# Altium project SAM9260-BSC-DK.PrjPcb (part 1 of 2)
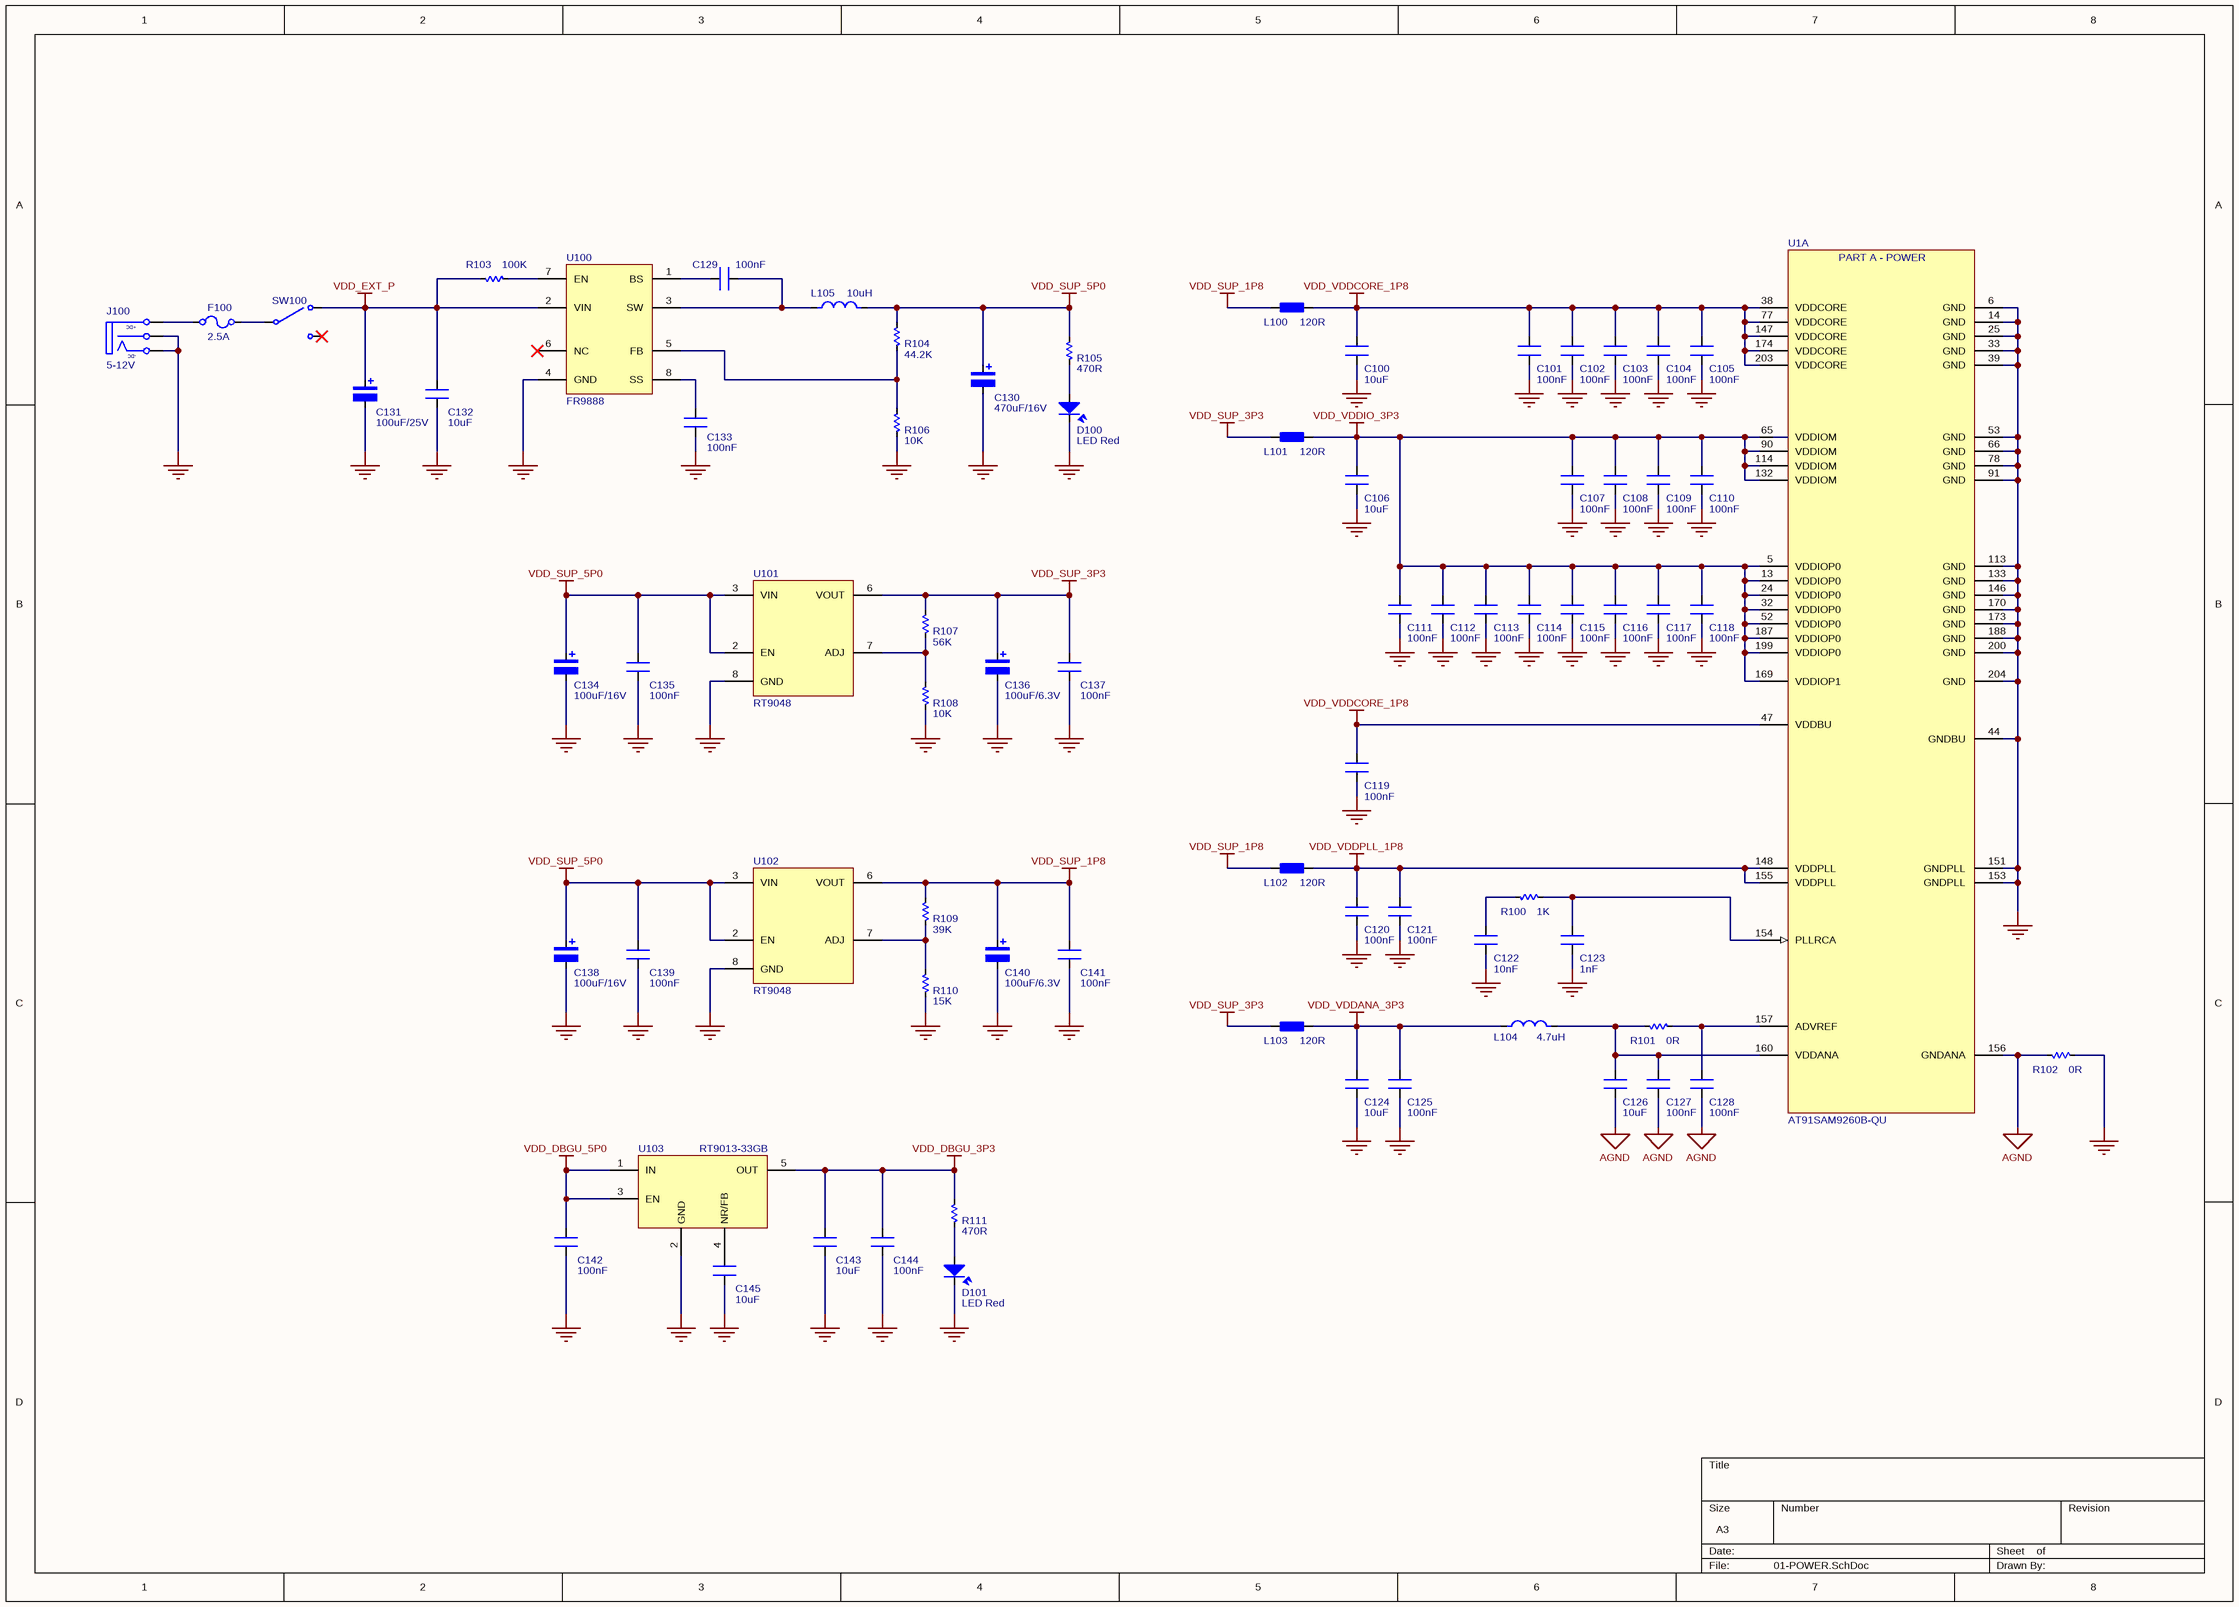
[diagram p0: 01-POWER.SchDoc]
7 sheets, 350 parts. Net scope: global (net labels, ports and power ports of the same name join across sheets).
Board file: SAM9260-BSC-DK.PcbDoc
Sheets:
  01-POWER.SchDoc
  02-MCU.SchDoc
  03-MEMORY.SchDoc
  04-ETHERNET.SchDoc
  05-SERIAL&USB.SchDoc
  06-AUDIO.SchDoc
  07-MISC.SchDoc

## Sheet 01-POWER.SchDoc
size A3

### Parts
C100  value 10uF  [CN-SMD-0603]  (hidden comment: Capacitor)
C101  value 100nF  [CN-SMD-0603]  (hidden comment: Capacitor)
C102  value 100nF  [CN-SMD-0603]  (hidden comment: Capacitor)
C103  value 100nF  [CN-SMD-0603]  (hidden comment: Capacitor)
C104  value 100nF  [CN-SMD-0603]  (hidden comment: Capacitor)
C105  value 100nF  [CN-SMD-0603]  (hidden comment: Capacitor)
C106  value 10uF  [CN-SMD-0603]  (hidden comment: Capacitor)
C107  value 100nF  [CN-SMD-0603]  (hidden comment: Capacitor)
C108  value 100nF  [CN-SMD-0603]  (hidden comment: Capacitor)
C109  value 100nF  [CN-SMD-0603]  (hidden comment: Capacitor)
C110  value 100nF  [CN-SMD-0603]  (hidden comment: Capacitor)
C111  value 100nF  [CN-SMD-0603]  (hidden comment: Capacitor)
C112  value 100nF  [CN-SMD-0603]  (hidden comment: Capacitor)
C113  value 100nF  [CN-SMD-0603]  (hidden comment: Capacitor)
C114  value 100nF  [CN-SMD-0603]  (hidden comment: Capacitor)
C115  value 100nF  [CN-SMD-0603]  (hidden comment: Capacitor)
C116  value 100nF  [CN-SMD-0603]  (hidden comment: Capacitor)
C117  value 100nF  [CN-SMD-0603]  (hidden comment: Capacitor)
C118  value 100nF  [CN-SMD-0603]  (hidden comment: Capacitor)
C119  value 100nF  [CN-SMD-0603]  (hidden comment: Capacitor)
C120  value 100nF  [CN-SMD-0603]  (hidden comment: Capacitor)
C121  value 100nF  [CN-SMD-0603]  (hidden comment: Capacitor)
C122  value 10nF  [CN-SMD-0603]  (hidden comment: Capacitor)
C123  value 1nF  [CN-SMD-0603]  (hidden comment: Capacitor)
C124  value 10uF  [CN-SMD-0603]  (hidden comment: Capacitor)
C125  value 100nF  [CN-SMD-0603]  (hidden comment: Capacitor)
C126  value 10uF  [CN-SMD-0603]  (hidden comment: Capacitor)
C127  value 100nF  [CN-SMD-0603]  (hidden comment: Capacitor)
C128  value 100nF  [CN-SMD-0603]  (hidden comment: Capacitor)
C129  value 100nF  [CN-SMD-0603]  (hidden comment: Capacitor)
C130  value 470uF/16V  [C-ALU-SMD-D6.3W6.6L7.7]  (hidden comment: Cap_Aluminum)
C131  value 100uF/25V  [C-ALU-SMD-D6.3W6.6L7.7]  (hidden comment: Cap_Aluminum)
C132  value 10uF  [CN-SMD-0603]  (hidden comment: Capacitor)
C133  value 100nF  [CN-SMD-0603]  (hidden comment: Capacitor)
C134  value 100uF/16V  [C-TAL-SMD-7343-31]  (hidden comment: Cap_Tantalum)
C135  value 100nF  [CN-SMD-0603]  (hidden comment: Capacitor)
C136  value 100uF/6.3V  [C-TAL-SMD-3216-18]  (hidden comment: Cap_Tantalum)
C137  value 100nF  [CN-SMD-0603]  (hidden comment: Capacitor)
C138  value 100uF/16V  [C-TAL-SMD-7343-31]  (hidden comment: Cap_Tantalum)
C139  value 100nF  [CN-SMD-0603]  (hidden comment: Capacitor)
C140  value 100uF/6.3V  [C-TAL-SMD-3216-18]  (hidden comment: Cap_Tantalum)
C141  value 100nF  [CN-SMD-0603]  (hidden comment: Capacitor)
C142  value 100nF  [CN-SMD-0603]  (hidden comment: Capacitor)
C143  value 10uF  [CN-SMD-0603]  (hidden comment: Capacitor)
C144  value 100nF  [CN-SMD-0603]  (hidden comment: Capacitor)
C145  value 10uF  [CN-SMD-0603]  (hidden comment: Capacitor)
D100  LED Red  [LED-SMD-0805-RED]
D101  LED Red  [LED-SMD-0805-RED]
F100  2.5A  [FUSE-SMD-1812]
J100  5-12V  [JACK-DC_5.5x2.1]
L100  value 120R  [L-SMD-0603]  (hidden comment: Ferrite bead)
L101  value 120R  [L-SMD-0603]  (hidden comment: Ferrite bead)
L102  value 120R  [L-SMD-0603]  (hidden comment: Ferrite bead)
L103  value 120R  [L-SMD-0603]  (hidden comment: Ferrite bead)
L104  value 4.7uH  [L-SMD-0603]  (hidden comment: Inductor)
L105  value 10uH  [L-SMD-0630]  (hidden comment: Inductor)
R100  value 1K  [RES-SMD-0603]  (hidden comment: Resistor)
R101  value 0R  [RES-SMD-0603]  (hidden comment: Resistor)
R102  value 0R  [RES-SMD-0603]  (hidden comment: Resistor)
R103  value 100K  [RES-SMD-0603]  (hidden comment: Resistor)
R104  value 44.2K  [RES-SMD-0603]  (hidden comment: Resistor)
R105  value 470R  [RES-SMD-0603]  (hidden comment: Resistor)
R106  value 10K  [RES-SMD-0603]  (hidden comment: Resistor)
R107  value 56K  [RES-SMD-0603]  (hidden comment: Resistor)
R108  value 10K  [RES-SMD-0603]  (hidden comment: Resistor)
R109  value 39K  [RES-SMD-0603]  (hidden comment: Resistor)
R110  value 15K  [RES-SMD-0603]  (hidden comment: Resistor)
R111  value 470R  [RES-SMD-0603]  (hidden comment: Resistor)
SW100  SW3-SLIDE  [SW3_SS12F23]  (value not drawn)
U1  AT91SAM9260B-QU  [PQFP50P3060X3060X410-208N]  (part A of 6)
U100  FR9888  [SOIC127P600X175_HS-9N]
U101  RT9048  [SOIC127P600X175_HS-9N]
U102  RT9048  [SOIC127P600X175_HS-9N]
U103  RT9013-33GB  [SOT95P245X110-5N]

### Nets
AGND: C126.1 C127.1 C128.1 R102.2 U1.156(GNDANA)
GND: C100.1 C101.1 C102.1 C103.1 C104.1 C105.1 C106.1 C107.1 C108.1 C109.1 C110.1 C111.1 C112.1 C113.1 C114.1 C115.1 C116.1 C117.1 C118.1 C119.1 C120.1 C121.1 C122.1 C123.1 C124.1 C125.1 C130.2 C131.2 C132.1 C133.1 C134.2 C135.1 C136.2 C137.1 C138.2 C139.1 C140.2 C141.1 C142.1 C143.1 C144.1 C145.1 D100.2 D101.2 J100.2(-DC) J100.3 R102.1 R106.2 R108.2 R110.2 U1.6(GND) U1.14(GND) U1.25(GND) U1.33(GND) U1.39(GND) U1.44(GNDBU) U1.53(GND) U1.66(GND) U1.78(GND) U1.91(GND) U1.113(GND) U1.133(GND) U1.146(GND) U1.151(GNDPLL) U1.153(GNDPLL) U1.170(GND) U1.173(GND) U1.188(GND) U1.200(GND) U1.204(GND) U100.4(GND) U101.8(GND) U102.8(GND) U103.2(GND)
VDD_DBGU_3P3: C143.2 C144.2 R111.1 U103.5(OUT)
VDD_DBGU_5P0: C142.2 U103.1(IN) U103.3(EN)
VDD_EXT_P: C131.1 C132.2 R103.2 SW100.1 U100.2(VIN)
VDD_SUP_1P8: C140.1 C141.2 L100.2 L102.2 R109.1 U102.6(VOUT)
VDD_SUP_3P3: C136.1 C137.2 L101.2 L103.2 R107.1 U101.6(VOUT)
VDD_SUP_5P0: C130.1 C134.1 C135.2 C138.1 C139.2 L105.2 R104.1 R105.1 U101.2(EN) U101.3(VIN) U102.2(EN) U102.3(VIN)
VDD_VDDANA_3P3: C124.2 C125.2 L103.1 L104.2
VDD_VDDCORE_1P8: C100.2 C101.2 C102.2 C103.2 C104.2 C105.2 C119.2 L100.1 U1.38(VDDCORE) U1.47(VDDBU) U1.77(VDDCORE) U1.147(VDDCORE) U1.174(VDDCORE) U1.203(VDDCORE)
VDD_VDDIO_3P3: C106.2 C107.2 C108.2 C109.2 C110.2 C111.2 C112.2 C113.2 C114.2 C115.2 C116.2 C117.2 C118.2 L101.1 U1.5(VDDIOP0) U1.13(VDDIOP0) U1.24(VDDIOP0) U1.32(VDDIOP0) U1.52(VDDIOP0) U1.65(VDDIOM) U1.90(VDDIOM) U1.114(VDDIOM) U1.132(VDDIOM) U1.169(VDDIOP1) U1.187(VDDIOP0) U1.199(VDDIOP0)
VDD_VDDPLL_1P8: C120.2 C121.2 L102.1 U1.148(VDDPLL) U1.155(VDDPLL)
NetC122_2: C122.2 R100.2
NetC123_2: C123.2 R100.1 U1.154(PLLRCA)
NetC126_2: C126.2 C127.2 L104.1 R101.2 U1.160(VDDANA)
NetC128_2: C128.2 R101.1 U1.157(ADVREF)
NetC129_1: C129.1 L105.1 U100.3(SW)
NetC129_2: C129.2 U100.1(BS)
NetC133_2: C133.2 U100.8(SS)
NetC145_2: C145.2 U103.4(NR/FB)
NetD100_1: D100.1 R105.2
NetD101_1: D101.1 R111.2
NetF100_1: F100.1 J100.1(+DC)
NetF100_2: F100.2 SW100.2
NetR103_1: R103.1 U100.7(EN)
NetR104_2: R104.2 R106.1 U100.5(FB)
NetR107_2: R107.2 R108.1 U101.7(ADJ)
NetR109_2: R109.2 R110.1 U102.7(ADJ)

Not connected (* = marked no-connect by the designer): SW100 3*; U100 6(NC)*

### Notes on the sheet
- (in symbol AT91SAM9260B-QU, part A) PART A - POWER

### Library data of the parts
C100 C106 C124 C126 = Cap: Ceramic Capacitor SMD 0603 10uF ±20% 10V
C101-C105 C107-C121 C125 C127-C129 C133 = Cap: Ceramic Capacitor SMD 0603 100nF ±20% 10V
C122 = Cap: Ceramic Capacitor SMD 0603 10nF ±20% 10V
C123 = Cap: Ceramic Capacitor SMD 0603 1nF ±20% 10V
C130 = Cap_Aluminum: Aluminum Capacitor SMD 470uF 16V
C131 = Cap_Aluminum: Aluminum Capacitor SMD 100uF 25V
C132 C143 C145 = Cap: Ceramic Capacitor SMD 0805 10uF ±20% 25V
C134 C138 = Cap_Tantalum: Tantalum Capacitor SMD 7343 100uF ±20% 16V
C135 C137 C139 C141 C142 C144 = Cap: Ceramic Capacitor SMD 0805 100nF ±20% 25V
C136 C140 = Cap_Tantalum: Tantalum Capacitor SMD 3216 100uF ±20% 6.3V
D100 D101 = LED: Light Emitting Diode SMD 0805 red color
F100 = FUSE: Fuse SMD1812 2.5A
J100 = DC_INPUT: DC Power Jack input 5.5x2.1mm
L100-L103 = Ferrite bead: Ferrite bead SMD 0603 120 Ohm @100MHz
L104 = Inductor: Common Inductor SMD 0603 4.7uH ±20%
L105 = Inductor: Power Inductor SMD 6.6x6.6x3mm
R100 = Res: Resistor SMD 0603 1K 1% 0.1W
R101 R102 = Res: Resistor SMD 0603 0R 1% 0.1W
R103 = Res: Resistor SMD 0603 100K 1% 0.1W
R104 = Res: Resistor SMD 0603 44.2K 1% 0.1W
R105 R111 = Res: Resistor SMD 0603 470R 1% 0.1W
R106 R108 = Res: Resistor SMD 0603 10K 1% 0.1W
R107 = Res: Resistor SMD 0603 56K 1% 0.1W
R109 = Res: Resistor SMD 0603 39K 1% 0.1W
R110 = Res: Resistor SMD 0603 15K 1% 0.1W
SW100 = SW3-SLIDE: Slide Switch 3-pin
U1 = AT91SAM9260B-QU: AT91 Series 180 MHz 32 kB Flash 8 kB SRAM 32-Bit Microcontroller - PQFP-208; MF: Microchip; MP: AT91SAM9260B-QU; Package: PQFP-208 Microchip; Price: None; SnapEDA_Link: https://www.snapeda.com/parts/AT91SAM9260B-QU/Microchip/view-part/?ref=snap; Availability: Unavailable; Value: *
U100 = FR9888: 23V, 3A, 340KHz Synchronous Step-Down / DC/DC Converter
U101 U102 = RT9048: Richtek 2A, Low Input Voltage, Ultra-Low Dropout Linear Regulator with Enable
U103 = TPS73633DBVR: Cap-Free, NMOS, 500-mA Low-Dropout Regulator with Reverse Current Protection

## Sheet 02-MCU.SchDoc
size A3
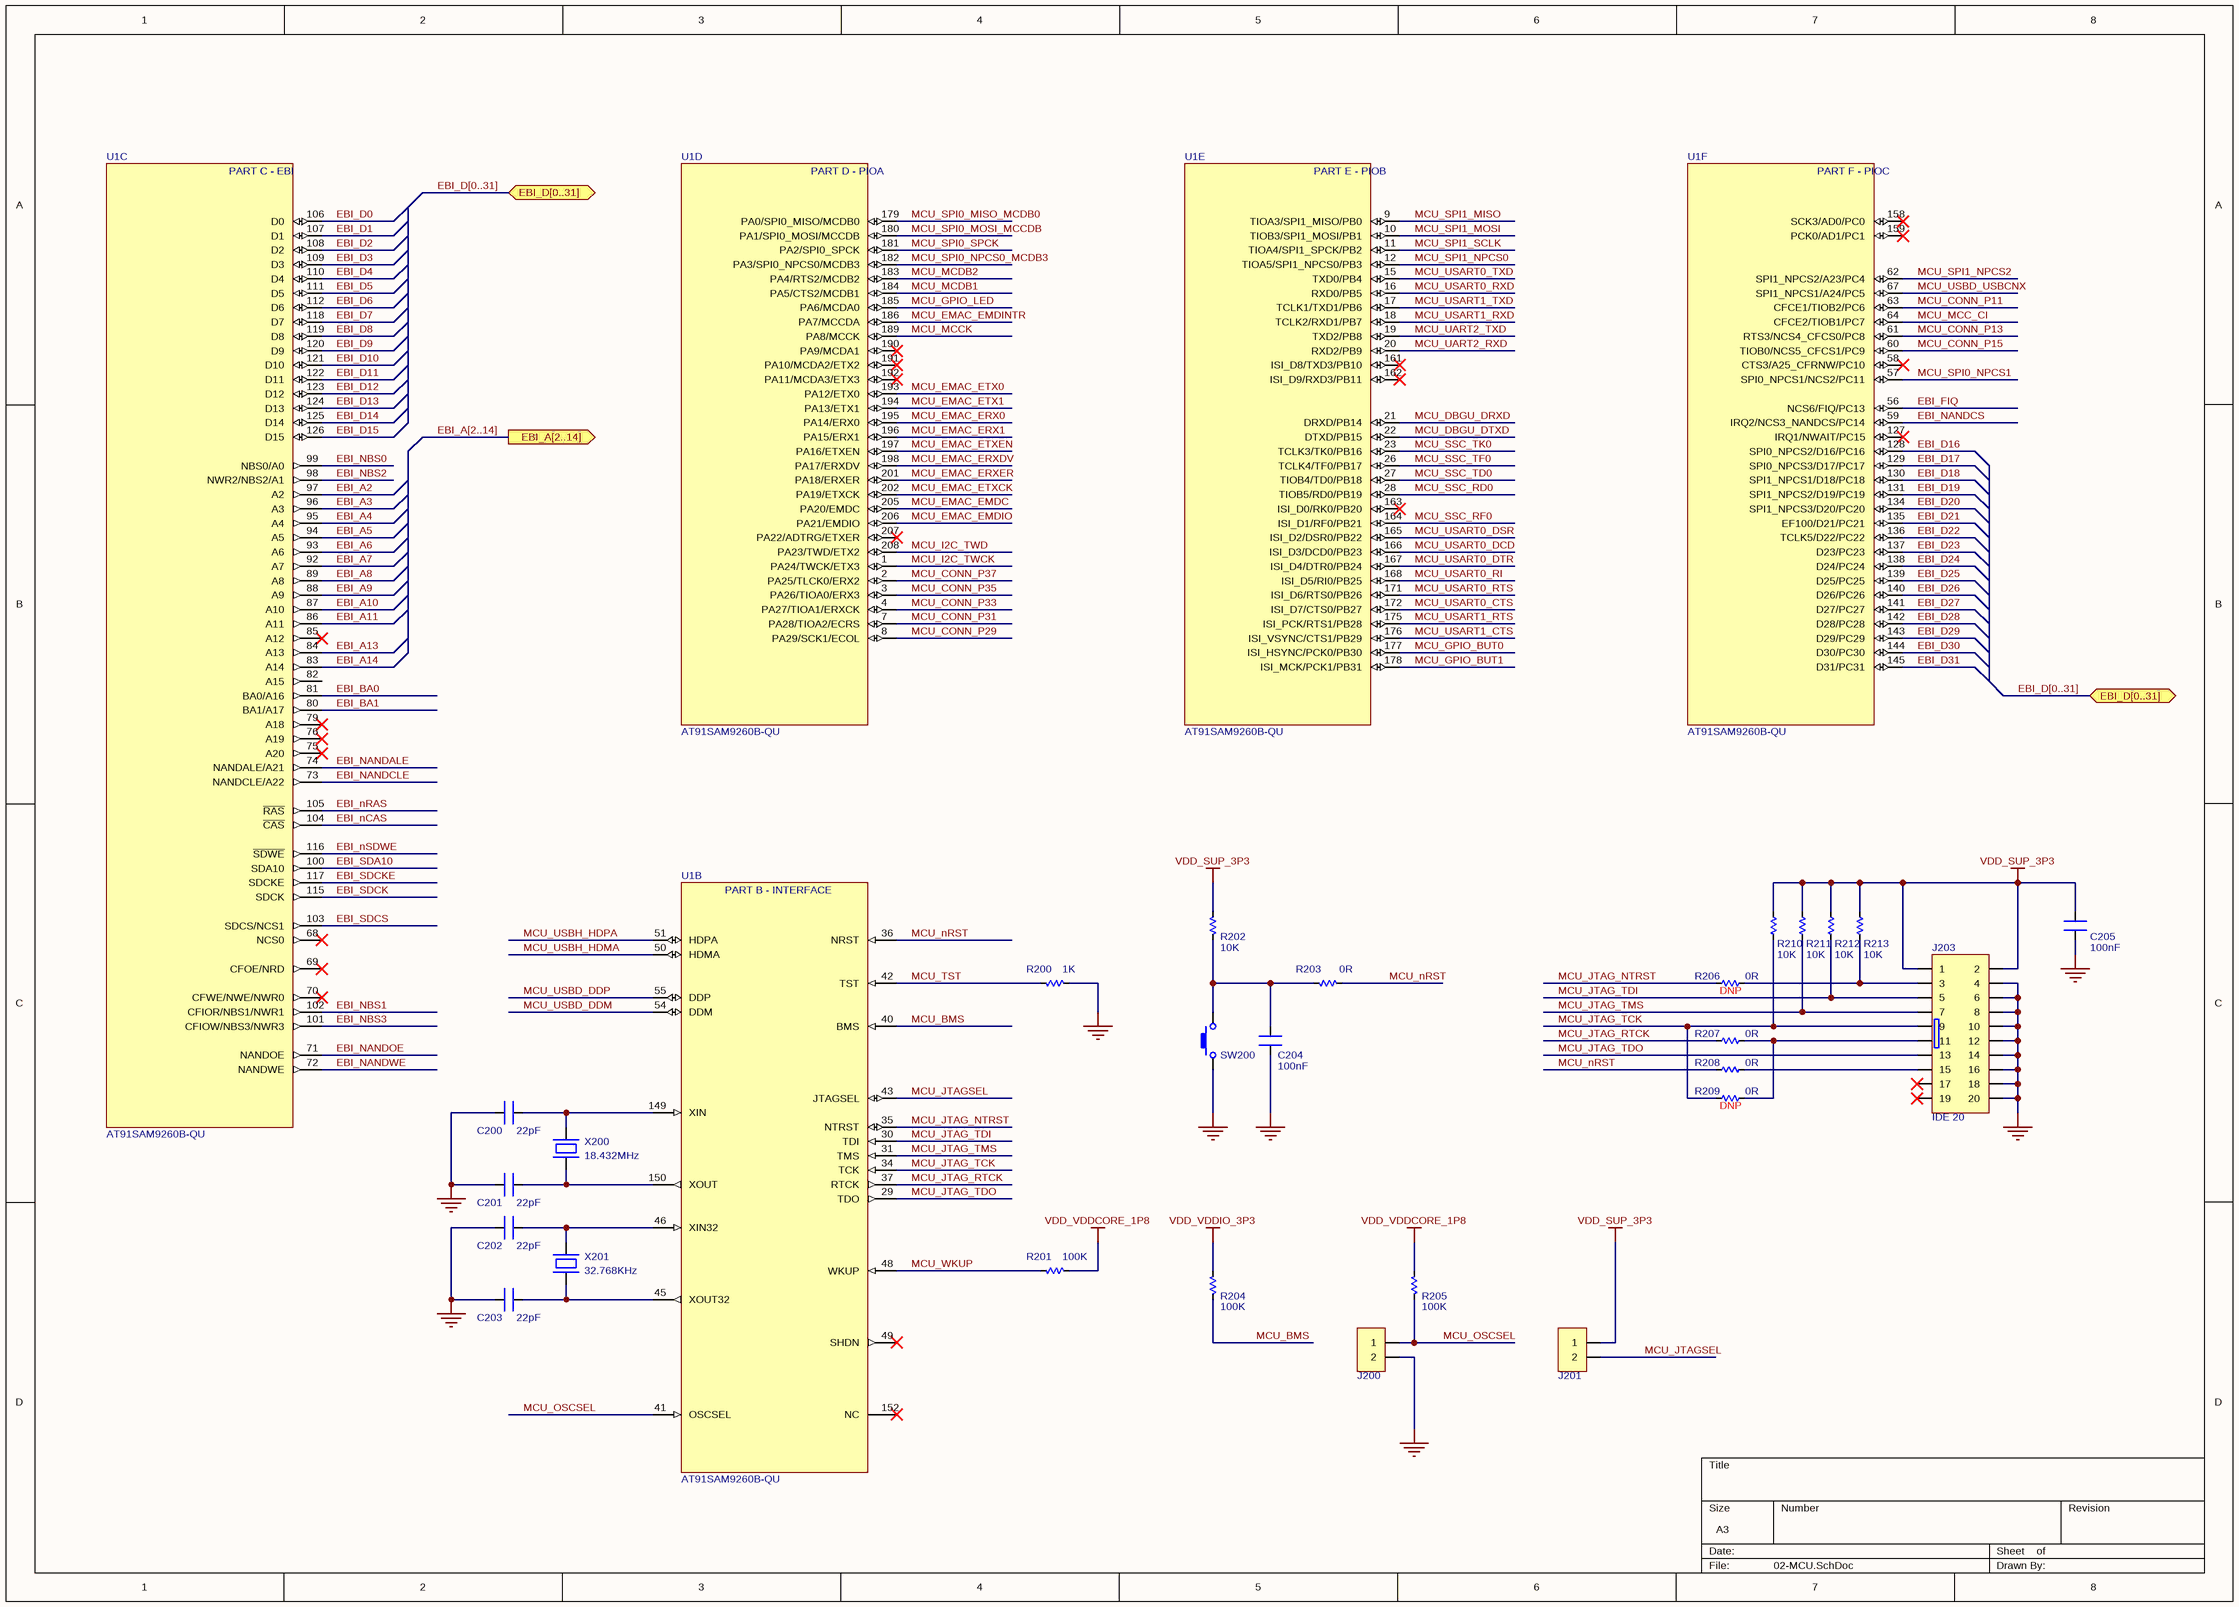
[diagram p1: 02-MCU.SchDoc]

### Parts
C200  value 22pF  [CN-SMD-0603]  (hidden comment: Capacitor)
C201  value 22pF  [CN-SMD-0603]  (hidden comment: Capacitor)
C202  value 22pF  [CN-SMD-0603]  (hidden comment: Capacitor)
C203  value 22pF  [CN-SMD-0603]  (hidden comment: Capacitor)
C204  value 100nF  [CN-SMD-0603]  (hidden comment: Capacitor)
C205  value 100nF  [CN-SMD-0603]  (hidden comment: Capacitor)
J200  JP2  [JP2-C1T]  (value not drawn)
J201  JP2  [JP2-C1T]  (value not drawn)
J203  IDE 20  [IDE-20V]
R200  value 1K  [RES-SMD-0603]  (hidden comment: Resistor)
R201  value 100K  [RES-SMD-0603]  (hidden comment: Resistor)
R202  value 10K  [RES-SMD-0603]  (hidden comment: Resistor)
R203  value 0R  [RES-SMD-0603]  (hidden comment: Resistor)
R204  value 100K  [RES-SMD-0603]  (hidden comment: Resistor)
R205  value 100K  [RES-SMD-0603]  (hidden comment: Resistor)
R206  value 0R  [RES-SMD-0603]  (hidden comment: Resistor)
R207  value 0R  [RES-SMD-0603]  (hidden comment: Resistor)
R208  value 0R  [RES-SMD-0603]  (hidden comment: Resistor)
R209  value 0R  [RES-SMD-0603]  (hidden comment: Resistor)
R210  value 10K  [RES-SMD-0603]  (hidden comment: Resistor)
R211  value 10K  [RES-SMD-0603]  (hidden comment: Resistor)
R212  value 10K  [RES-SMD-0603]  (hidden comment: Resistor)
R213  value 10K  [RES-SMD-0603]  (hidden comment: Resistor)
SW200  SW2  [SW2-SMD-3x4x2M]  (value not drawn)
U1  AT91SAM9260B-QU  [PQFP50P3060X3060X410-208N]  (parts B,C,D,E,F of 6)
X200  value 18.432MHz  [XT-SMD-5032-2P]  (hidden comment: Crystal)
X201  value 32.768KHz  [XT-SMD-FC-135]  (hidden comment: Crystal)

### Ports
EBI_A[2..14] (out), EBI_D[0..31] (bidir)

### Nets
GND: C200.2 C201.2 C202.2 C203.2 C204.1 C205.1 J200.2 J203.4 J203.6 J203.8 J203.10 J203.12 J203.14 J203.16 J203.18 J203.20 R200.1 SW200.1
VDD_SUP_3P3: C205.2 J201.1 J203.1 J203.2 R202.1 R210.1 R211.1 R212.1 R213.1
VDD_VDDCORE_1P8: R201.1 R205.1
VDD_VDDIO_3P3: R204.1
EBI_A2: U1.97(A2)
EBI_A3: U1.96(A3)
EBI_A4: U1.95(A4)
EBI_A5: U1.94(A5)
EBI_A6: U1.93(A6)
EBI_A7: U1.92(A7)
EBI_A8: U1.89(A8)
EBI_A9: U1.88(A9)
EBI_A10: U1.87(A10)
EBI_A11: U1.86(A11)
EBI_A13: U1.84(A13)
EBI_A14: U1.83(A14)
EBI_BA0: U1.81(BA0/A16)
EBI_BA1: U1.80(BA1/A17)
EBI_D0: U1.106(D0)
EBI_D1: U1.107(D1)
EBI_D2: U1.108(D2)
EBI_D3: U1.109(D3)
EBI_D4: U1.110(D4)
EBI_D5: U1.111(D5)
EBI_D6: U1.112(D6)
EBI_D7: U1.118(D7)
EBI_D8: U1.119(D8)
EBI_D9: U1.120(D9)
EBI_D10: U1.121(D10)
EBI_D11: U1.122(D11)
EBI_D12: U1.123(D12)
EBI_D13: U1.124(D13)
EBI_D14: U1.125(D14)
EBI_D15: U1.126(D15)
EBI_D16: U1.128(SPI0_NPCS2/D16/PC16)
EBI_D17: U1.129(SPI0_NPCS3/D17/PC17)
EBI_D18: U1.130(SPI1_NPCS1/D18/PC18)
EBI_D19: U1.131(SPI1_NPCS2/D19/PC19)
EBI_D20: U1.134(SPI1_NPCS3/D20/PC20)
EBI_D21: U1.135(EF100/D21/PC21)
EBI_D22: U1.136(TCLK5/D22/PC22)
EBI_D23: U1.137(D23/PC23)
EBI_D24: U1.138(D24/PC24)
EBI_D25: U1.139(D25/PC25)
EBI_D26: U1.140(D26/PC26)
EBI_D27: U1.141(D27/PC27)
EBI_D28: U1.142(D28/PC28)
EBI_D29: U1.143(D29/PC29)
EBI_D30: U1.144(D30/PC30)
EBI_D31: U1.145(D31/PC31)
EBI_FIQ: U1.56(NCS6/FIQ/PC13)
EBI_NANDALE: U1.74(NANDALE/A21)
EBI_NANDCLE: U1.73(NANDCLE/A22)
EBI_NANDCS: U1.59(IRQ2/NCS3_NANDCS/PC14)
EBI_NANDOE: U1.71(NANDOE)
EBI_NANDWE: U1.72(NANDWE)
EBI_NBS0: U1.99(NBS0/A0)
EBI_NBS1: U1.102(CFIOR/NBS1/NWR1)
EBI_NBS2: U1.98(NWR2/NBS2/A1)
EBI_NBS3: U1.101(CFIOW/NBS3/NWR3)
EBI_nCAS: U1.104(~{CAS})
EBI_nRAS: U1.105(~{RAS})
EBI_nSDWE: U1.116(~{SDWE})
EBI_SDA10: U1.100(SDA10)
EBI_SDCK: U1.115(SDCK)
EBI_SDCKE: U1.117(SDCKE)
EBI_SDCS: U1.103(SDCS/NCS1)
MCU_BMS: R204.2 U1.40(BMS)
MCU_CONN_P11: U1.63(CFCE1/TIOB2/PC6)
MCU_CONN_P13: U1.61(RTS3/NCS4_CFCS0/PC8)
MCU_CONN_P15: U1.60(TIOB0/NCS5_CFCS1/PC9)
MCU_CONN_P29: U1.8(PA29/SCK1/ECOL)
MCU_CONN_P31: U1.7(PA28/TIOA2/ECRS)
MCU_CONN_P33: U1.4(PA27/TIOA1/ERXCK)
MCU_CONN_P35: U1.3(PA26/TIOA0/ERX3)
MCU_CONN_P37: U1.2(PA25/TLCK0/ERX2)
MCU_DBGU_DRXD: U1.21(DRXD/PB14)
MCU_DBGU_DTXD: U1.22(DTXD/PB15)
MCU_EMAC_EMDC: U1.205(PA20/EMDC)
MCU_EMAC_EMDINTR: U1.186(PA7/MCCDA)
MCU_EMAC_EMDIO: U1.206(PA21/EMDIO)
MCU_EMAC_ERX0: U1.195(PA14/ERX0)
MCU_EMAC_ERX1: U1.196(PA15/ERX1)
MCU_EMAC_ERXDV: U1.198(PA17/ERXDV)
MCU_EMAC_ERXER: U1.201(PA18/ERXER)
MCU_EMAC_ETX0: U1.193(PA12/ETX0)
MCU_EMAC_ETX1: U1.194(PA13/ETX1)
MCU_EMAC_ETXCK: U1.202(PA19/ETXCK)
MCU_EMAC_ETXEN: U1.197(PA16/ETXEN)
MCU_GPIO_BUT0: U1.177(ISI_HSYNC/PCK0/PB30)
MCU_GPIO_BUT1: U1.178(ISI_MCK/PCK1/PB31)
MCU_GPIO_LED: U1.185(PA6/MCDA0)
MCU_I2C_TWCK: U1.1(PA24/TWCK/ETX3)
MCU_I2C_TWD: U1.208(PA23/TWD/ETX2)
MCU_JTAG_NTRST: R206.2 U1.35(NTRST)
MCU_JTAG_RTCK: R207.2 U1.37(RTCK)
MCU_JTAG_TCK: J203.9 R209.2 R210.2 U1.34(TCK)
MCU_JTAG_TDI: J203.5 R212.2 U1.30(TDI)
MCU_JTAG_TDO: J203.13 U1.29(TDO)
MCU_JTAG_TMS: J203.7 R211.2 U1.31(TMS)
MCU_JTAGSEL: J201.2 U1.43(JTAGSEL)
MCU_MCC_CI: U1.64(CFCE2/TIOB1/PC7)
MCU_MCCK: U1.189(PA8/MCCK)
MCU_MCDB1: U1.184(PA5/CTS2/MCDB1)
MCU_MCDB2: U1.183(PA4/RTS2/MCDB2)
MCU_nRST: R203.2 R208.2 U1.36(NRST)
MCU_OSCSEL: J200.1 R205.2 U1.41(OSCSEL)
MCU_SPI0_MISO_MCDB0: U1.179(PA0/SPI0_MISO/MCDB0)
MCU_SPI0_MOSI_MCCDB: U1.180(PA1/SPI0_MOSI/MCCDB)
MCU_SPI0_NPCS0_MCDB3: U1.182(PA3/SPI0_NPCS0/MCDB3)
MCU_SPI0_NPCS1: U1.57(SPI0_NPCS1/NCS2/PC11)
MCU_SPI0_SPCK: U1.181(PA2/SPI0_SPCK)
MCU_SPI1_MISO: U1.9(TIOA3/SPI1_MISO/PB0)
MCU_SPI1_MOSI: U1.10(TIOB3/SPI1_MOSI/PB1)
MCU_SPI1_NPCS0: U1.12(TIOA5/SPI1_NPCS0/PB3)
MCU_SPI1_NPCS2: U1.62(SPI1_NPCS2/A23/PC4)
MCU_SPI1_SCLK: U1.11(TIOA4/SPI1_SPCK/PB2)
MCU_SSC_RD0: U1.28(TIOB5/RD0/PB19)
MCU_SSC_RF0: U1.164(ISI_D1/RF0/PB21)
MCU_SSC_TD0: U1.27(TIOB4/TD0/PB18)
MCU_SSC_TF0: U1.26(TCLK4/TF0/PB17)
MCU_SSC_TK0: U1.23(TCLK3/TK0/PB16)
MCU_TST: R200.2 U1.42(TST)
MCU_UART2_RXD: U1.20(RXD2/PB9)
MCU_UART2_TXD: U1.19(TXD2/PB8)
MCU_USART0_CTS: U1.172(ISI_D7/CTS0/PB27)
MCU_USART0_DCD: U1.166(ISI_D3/DCD0/PB23)
MCU_USART0_DSR: U1.165(ISI_D2/DSR0/PB22)
MCU_USART0_DTR: U1.167(ISI_D4/DTR0/PB24)
MCU_USART0_RI: U1.168(ISI_D5/RI0/PB25)
MCU_USART0_RTS: U1.171(ISI_D6/RTS0/PB26)
MCU_USART0_RXD: U1.16(RXD0/PB5)
MCU_USART0_TXD: U1.15(TXD0/PB4)
MCU_USART1_CTS: U1.176(ISI_VSYNC/CTS1/PB29)
MCU_USART1_RTS: U1.175(ISI_PCK/RTS1/PB28)
MCU_USART1_RXD: U1.18(TCLK2/RXD1/PB7)
MCU_USART1_TXD: U1.17(TCLK1/TXD1/PB6)
MCU_USBD_DDM: U1.54(DDM)
MCU_USBD_DDP: U1.55(DDP)
MCU_USBD_USBCNX: U1.67(SPI1_NPCS1/A24/PC5)
MCU_USBH_HDMA: U1.50(HDMA)
MCU_USBH_HDPA: U1.51(HDPA)
MCU_WKUP: R201.2 U1.48(WKUP)
NetC200_1: C200.1 U1.149(XIN) X200.1
NetC201_1: C201.1 U1.150(XOUT) X200.2
NetC202_1: C202.1 U1.46(XIN32) X201.1
NetC203_1: C203.1 U1.45(XOUT32) X201.2
NetC204_2: C204.2 R202.2 R203.1 SW200.2
NetJ203_3: J203.3 R206.1 R213.2
NetJ203_11: J203.11 R207.1 R209.1
NetJ203_15: J203.15 R208.1

Not connected (* = marked no-connect by the designer): J203 17* 19*; U1 49(SHDN)* 58(CTS3/A25_CFRNW/PC10)* 68(NCS0)* 69(CFOE/NRD)* 70(CFWE/NWE/NWR0)* 75(A20)* 76(A19)* 79(A18)* 82(A15) 85(A12)* 127(IRQ1/NWAIT/PC15)* 152(NC)* 158(SCK3/AD0/PC0)* 159(PCK0/AD1/PC1)* 161(ISI_D8/TXD3/PB10)* 162(ISI_D9/RXD3/PB11)* 163(ISI_D0/RK0/PB20)* 190(PA9/MCDA1)* 191(PA10/MCDA2/ETX2)* 192(PA11/MCDA3/ETX3)* 207(PA22/ADTRG/ETXER)*

### Buses and harness runs
bus EBI_A[2..14] = port EBI_A[2..14]
bus EBI_D[0..31] = port EBI_D[0..31]

### Notes on the sheet
- (near R206) DNP
- (near R209) DNP
- (in symbol AT91SAM9260B-QU, part B) PART B - INTERFACE
- (in symbol AT91SAM9260B-QU, part C) PART C - EBI
- (in symbol AT91SAM9260B-QU, part D) PART D - PIOA
- (in symbol AT91SAM9260B-QU, part E) PART E - PIOB
- (in symbol AT91SAM9260B-QU, part F) PART F - PIOC

### Library data of the parts
C200-C203 = Cap: Ceramic Capacitor SMD 0603 22pF ±20% 10V
C204 C205 = Cap: as C101 on sheet 01-POWER
J200 J201 = JP2: Single 2-pin jumper
J203 = IDE 20: IDE-20 male 2.54mm right-angle header; Value: Header 5x2
R200 = Res: Resistor SMD 0603 1K 1% 0.1W
R201 R204 R205 = Res: Resistor SMD 0603 100K 1% 0.1W
R202 R210-R213 = Res: Resistor SMD 0603 10K 1% 0.1W
R203 R206-R209 = Res: Resistor SMD 0603 0R 1% 0.1W
SW200 = SW2: Switch 2-pin SMD 3x4x2mm
U1 = AT91SAM9260B-QU: as U1 on sheet 01-POWER; MP: AT91SAM9260B-QU; Package: PQFP-208 Microchip; Price: None; SnapEDA_Link: https://www.snapeda.com/parts/AT91SAM9260B-QU/Microchip/view-part/?ref=snap; Availability: Unavailable; Value: *
X200 = XT2: Crystal Oscillator 18.432MHz SMD-5032 2-pin
X201 = XT2: Crystal Oscillator 32.768KHz FC-135 2-pin

## Sheet 03-MEMORY.SchDoc
size A3
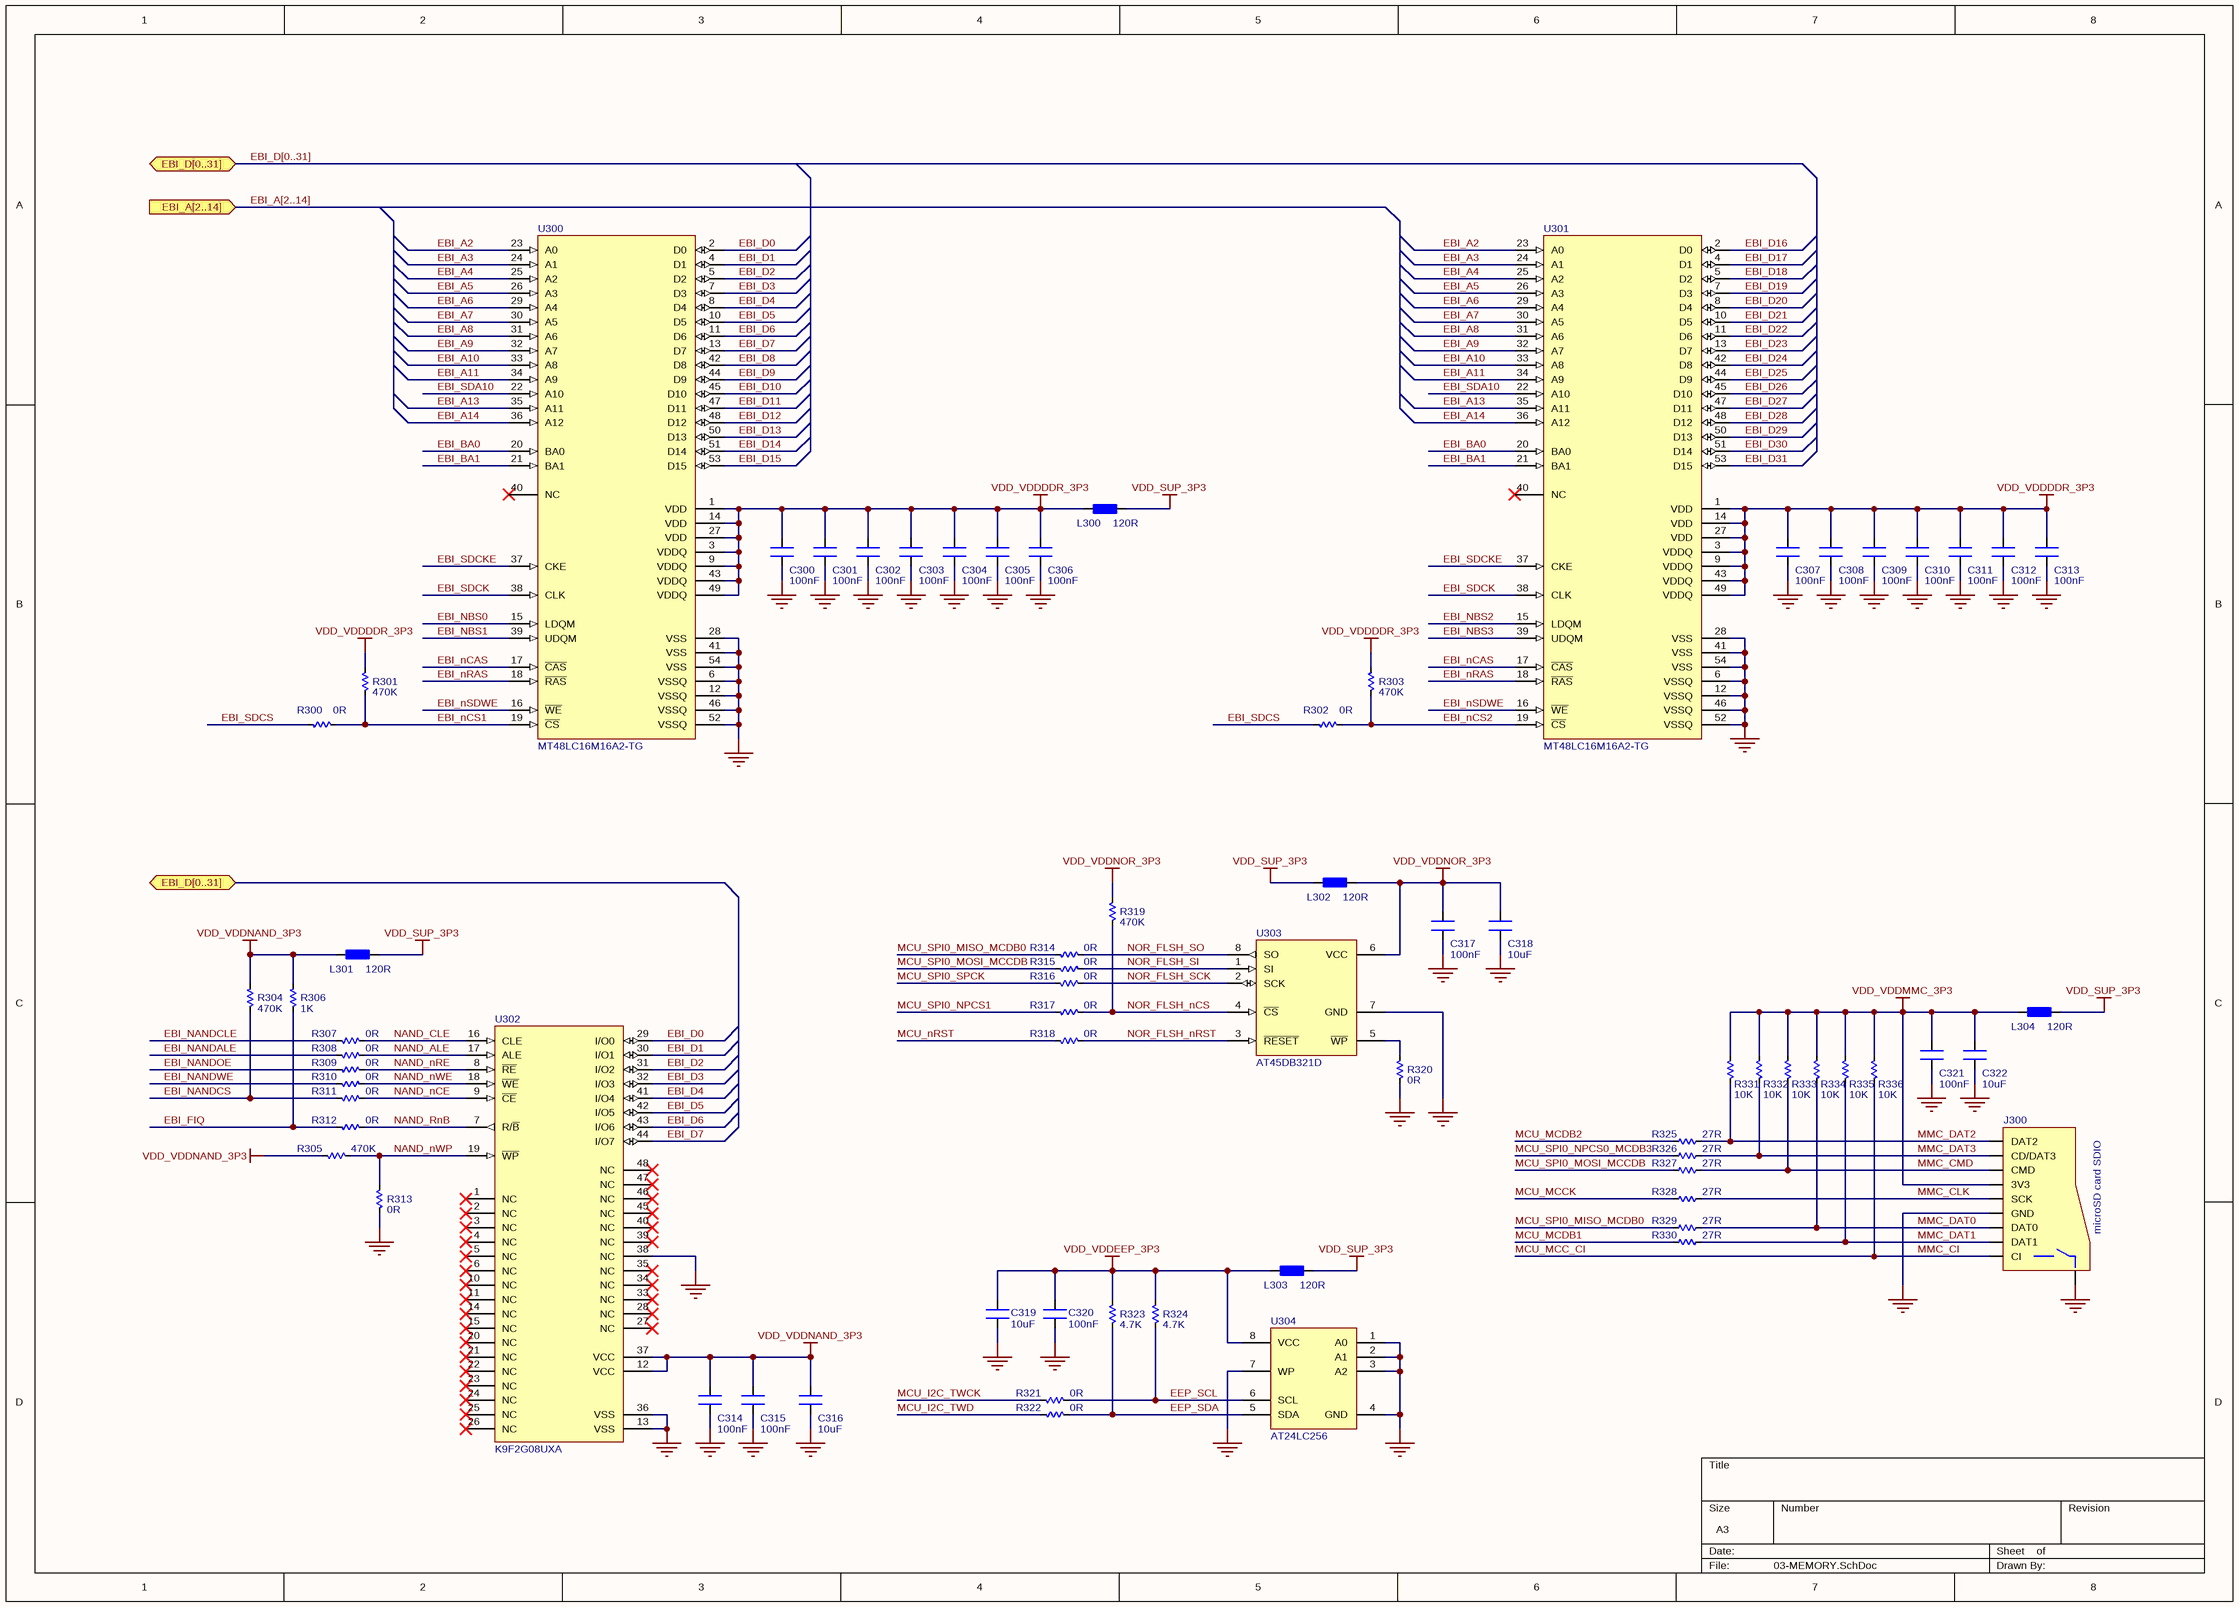
[diagram p2: 03-MEMORY.SchDoc]

### Parts
C300  value 100nF  [CN-SMD-0603]  (hidden comment: Capacitor)
C301  value 100nF  [CN-SMD-0603]  (hidden comment: Capacitor)
C302  value 100nF  [CN-SMD-0603]  (hidden comment: Capacitor)
C303  value 100nF  [CN-SMD-0603]  (hidden comment: Capacitor)
C304  value 100nF  [CN-SMD-0603]  (hidden comment: Capacitor)
C305  value 100nF  [CN-SMD-0603]  (hidden comment: Capacitor)
C306  value 100nF  [CN-SMD-0603]  (hidden comment: Capacitor)
C307  value 100nF  [CN-SMD-0603]  (hidden comment: Capacitor)
C308  value 100nF  [CN-SMD-0603]  (hidden comment: Capacitor)
C309  value 100nF  [CN-SMD-0603]  (hidden comment: Capacitor)
C310  value 100nF  [CN-SMD-0603]  (hidden comment: Capacitor)
C311  value 100nF  [CN-SMD-0603]  (hidden comment: Capacitor)
C312  value 100nF  [CN-SMD-0603]  (hidden comment: Capacitor)
C313  value 100nF  [CN-SMD-0603]  (hidden comment: Capacitor)
C314  value 100nF  [CN-SMD-0603]  (hidden comment: Capacitor)
C315  value 100nF  [CN-SMD-0603]  (hidden comment: Capacitor)
C316  value 10uF  [CN-SMD-0603]  (hidden comment: Capacitor)
C317  value 100nF  [CN-SMD-0603]  (hidden comment: Capacitor)
C318  value 10uF  [CN-SMD-0603]  (hidden comment: Capacitor)
C319  value 10uF  [CN-SMD-0603]  (hidden comment: Capacitor)
C320  value 100nF  [CN-SMD-0603]  (hidden comment: Capacitor)
C321  value 100nF  [CN-SMD-0603]  (hidden comment: Capacitor)
C322  value 10uF  [CN-SMD-0603]  (hidden comment: Capacitor)
J300  microSD card SDIO  [MICROSD1]
L300  value 120R  [L-SMD-0603]  (hidden comment: Ferrite bead)
L301  value 120R  [L-SMD-0603]  (hidden comment: Ferrite bead)
L302  value 120R  [L-SMD-0603]  (hidden comment: Ferrite bead)
L303  value 120R  [L-SMD-0603]  (hidden comment: Ferrite bead)
L304  value 120R  [L-SMD-0603]  (hidden comment: Ferrite bead)
R300  value 0R  [RES-SMD-0603]  (hidden comment: Resistor)
R301  value 470K  [RES-SMD-0603]  (hidden comment: Resistor)
R302  value 0R  [RES-SMD-0603]  (hidden comment: Resistor)
R303  value 470K  [RES-SMD-0603]  (hidden comment: Resistor)
R304  value 470K  [RES-SMD-0603]  (hidden comment: Resistor)
R305  value 470K  [RES-SMD-0603]  (hidden comment: Resistor)
R306  value 1K  [RES-SMD-0603]  (hidden comment: Resistor)
R307  value 0R  [RES-SMD-0603]  (hidden comment: Resistor)
R308  value 0R  [RES-SMD-0603]  (hidden comment: Resistor)
R309  value 0R  [RES-SMD-0603]  (hidden comment: Resistor)
R310  value 0R  [RES-SMD-0603]  (hidden comment: Resistor)
R311  value 0R  [RES-SMD-0603]  (hidden comment: Resistor)
R312  value 0R  [RES-SMD-0603]  (hidden comment: Resistor)
R313  value 0R  [RES-SMD-0603]  (hidden comment: Resistor)
R314  value 0R  [RES-SMD-0603]  (hidden comment: Resistor)
R315  value 0R  [RES-SMD-0603]  (hidden comment: Resistor)
R316  value 0R  [RES-SMD-0603]  (hidden comment: Resistor)
R317  value 0R  [RES-SMD-0603]  (hidden comment: Resistor)
R318  value 0R  [RES-SMD-0603]  (hidden comment: Resistor)
R319  value 470K  [RES-SMD-0603]  (hidden comment: Resistor)
R320  value 0R  [RES-SMD-0603]  (hidden comment: Resistor)
R321  value 0R  [RES-SMD-0603]  (hidden comment: Resistor)
R322  value 0R  [RES-SMD-0603]  (hidden comment: Resistor)
R323  value 4.7K  [RES-SMD-0603]  (hidden comment: Resistor)
R324  value 4.7K  [RES-SMD-0603]  (hidden comment: Resistor)
R325  27R  [RES-SMD-0603]
R326  27R  [RES-SMD-0603]
R327  27R  [RES-SMD-0603]
R328  27R  [RES-SMD-0603]
R329  27R  [RES-SMD-0603]
R330  27R  [RES-SMD-0603]
R331  value 10K  [RES-SMD-0603]  (hidden comment: Resistor)
R332  value 10K  [RES-SMD-0603]  (hidden comment: Resistor)
R333  value 10K  [RES-SMD-0603]  (hidden comment: Resistor)
R334  value 10K  [RES-SMD-0603]  (hidden comment: Resistor)
R335  value 10K  [RES-SMD-0603]  (hidden comment: Resistor)
R336  value 10K  [RES-SMD-0603]  (hidden comment: Resistor)
U300  MT48LC16M16A2-TG  [TSOP80P1180X120-54N]
U301  MT48LC16M16A2-TG  [TSOP80P1180X120-54N]
U302  K9F2G08UXA  [TSOP50P2000X120-48N]
U303  AT45DB321D  [SOIC127P798X216-8N]
U304  AT24LC256  [SOIC127P600X175-8N]

### Ports
EBI_A[2..14] (in), EBI_D[0..31] (bidir)

### Nets
GND: C300.1 C301.1 C302.1 C303.1 C304.1 C305.1 C306.1 C307.1 C308.1 C309.1 C310.1 C311.1 C312.1 C313.1 C314.1 C315.1 C316.1 C317.1 C318.1 C319.1 C320.1 C321.1 C322.1 J300.6(GND) J300.?1(NC) R313.2 R320.2 U300.6(VSSQ) U300.12(VSSQ) U300.28(VSS) U300.41(VSS) U300.46(VSSQ) U300.52(VSSQ) U300.54(VSS) U301.6(VSSQ) U301.12(VSSQ) U301.28(VSS) U301.41(VSS) U301.46(VSSQ) U301.52(VSSQ) U301.54(VSS) U302.13(VSS) U302.36(VSS) U302.38(NC) U303.7(GND) U304.1(A0) U304.2(A1) U304.3(A2) U304.4(GND) U304.7(WP)
VDD_SUP_3P3: L300.2 L301.2 L302.2 L303.2 L304.2
VDD_VDDDDR_3P3: C300.2 C301.2 C302.2 C303.2 C304.2 C305.2 C306.2 C307.2 C308.2 C309.2 C310.2 C311.2 C312.2 C313.2 L300.1 R301.1 R303.1 U300.1(VDD) U300.3(VDDQ) U300.9(VDDQ) U300.14(VDD) U300.27(VDD) U300.43(VDDQ) U300.49(VDDQ) U301.1(VDD) U301.3(VDDQ) U301.9(VDDQ) U301.14(VDD) U301.27(VDD) U301.43(VDDQ) U301.49(VDDQ)
VDD_VDDEEP_3P3: C319.2 C320.2 L303.1 R323.1 R324.1 U304.8(VCC)
VDD_VDDMMC_3P3: C321.2 C322.2 J300.4(3V3) L304.1 R331.1 R332.1 R333.1 R334.1 R335.1 R336.1
VDD_VDDNAND_3P3: C314.2 C315.2 C316.2 L301.1 R304.1 R305.2 R306.1 U302.12(VCC) U302.37(VCC)
VDD_VDDNOR_3P3: C317.2 C318.2 L302.1 R319.1 U303.6(VCC)
EBI_A2: U300.23(A0) U301.23(A0)
EBI_A3: U300.24(A1) U301.24(A1)
EBI_A4: U300.25(A2) U301.25(A2)
EBI_A5: U300.26(A3) U301.26(A3)
EBI_A6: U300.29(A4) U301.29(A4)
EBI_A7: U300.30(A5) U301.30(A5)
EBI_A8: U300.31(A6) U301.31(A6)
EBI_A9: U300.32(A7) U301.32(A7)
EBI_A10: U300.33(A8) U301.33(A8)
EBI_A11: U300.34(A9) U301.34(A9)
EBI_A13: U300.35(A11) U301.35(A11)
EBI_A14: U300.36(A12) U301.36(A12)
EBI_BA0: U300.20(BA0) U301.20(BA0)
EBI_BA1: U300.21(BA1) U301.21(BA1)
EBI_D0: U300.2(D0) U302.29(I/O0)
EBI_D1: U300.4(D1) U302.30(I/O1)
EBI_D2: U300.5(D2) U302.31(I/O2)
EBI_D3: U300.7(D3) U302.32(I/O3)
EBI_D4: U300.8(D4) U302.41(I/O4)
EBI_D5: U300.10(D5) U302.42(I/O5)
EBI_D6: U300.11(D6) U302.43(I/O6)
EBI_D7: U300.13(D7) U302.44(I/O7)
EBI_D8: U300.42(D8)
EBI_D9: U300.44(D9)
EBI_D10: U300.45(D10)
EBI_D11: U300.47(D11)
EBI_D12: U300.48(D12)
EBI_D13: U300.50(D13)
EBI_D14: U300.51(D14)
EBI_D15: U300.53(D15)
EBI_D16: U301.2(D0)
EBI_D17: U301.4(D1)
EBI_D18: U301.5(D2)
EBI_D19: U301.7(D3)
EBI_D20: U301.8(D4)
EBI_D21: U301.10(D5)
EBI_D22: U301.11(D6)
EBI_D23: U301.13(D7)
EBI_D24: U301.42(D8)
EBI_D25: U301.44(D9)
EBI_D26: U301.45(D10)
EBI_D27: U301.47(D11)
EBI_D28: U301.48(D12)
EBI_D29: U301.50(D13)
EBI_D30: U301.51(D14)
EBI_D31: U301.53(D15)
EBI_FIQ: R306.2 R312.2
EBI_NANDALE: R308.2
EBI_NANDCLE: R307.2
EBI_NANDCS: R304.2 R311.2
EBI_NANDOE: R309.2
EBI_NANDWE: R310.2
EBI_NBS0: U300.15(LDQM)
EBI_NBS1: U300.39(UDQM)
EBI_NBS2: U301.15(LDQM)
EBI_NBS3: U301.39(UDQM)
EBI_nCAS: U300.17(~{CAS}) U301.17(~{CAS})
EBI_nCS1: R300.1 R301.2 U300.19(~{CS})
EBI_nCS2: R302.1 R303.2 U301.19(~{CS})
EBI_nRAS: U300.18(~{RAS}) U301.18(~{RAS})
EBI_nSDWE: U300.16(~{WE}) U301.16(~{WE})
EBI_SDA10: U300.22(A10) U301.22(A10)
EBI_SDCK: U300.38(CLK) U301.38(CLK)
EBI_SDCKE: U300.37(CKE) U301.37(CKE)
EBI_SDCS: R300.2 R302.2
EEP_SCL: R321.1 R324.2 U304.6(SCL)
EEP_SDA: R322.1 R323.2 U304.5(SDA)
MCU_I2C_TWCK: R321.2
MCU_I2C_TWD: R322.2
MCU_MCC_CI: J300.9(CI) R336.2  [also labelled MMC_CI]
MCU_MCCK: R328.1
MCU_MCDB1: R330.1
MCU_MCDB2: R325.1
MCU_nRST: R318.2
MCU_SPI0_MISO_MCDB0: R314.2 R329.1
MCU_SPI0_MOSI_MCCDB: R315.2 R327.1
MCU_SPI0_NPCS0_MCDB3: R326.1
MCU_SPI0_NPCS1: R317.2
MCU_SPI0_SPCK: R316.2
MMC_CLK: J300.5(SCK) R328.2
MMC_CMD: J300.3(CMD) R327.2 R333.2
MMC_DAT0: J300.7(DAT0) R329.2 R334.2
MMC_DAT1: J300.8(DAT1) R330.2 R335.2
MMC_DAT2: J300.1(DAT2) R325.2 R331.2
MMC_DAT3: J300.2(CD/DAT3) R326.2 R332.2
NAND_ALE: R308.1 U302.17(ALE)
NAND_CLE: R307.1 U302.16(CLE)
NAND_nCE: R311.1 U302.9(~{CE})
NAND_nRE: R309.1 U302.8(~{RE})
NAND_nWE: R310.1 U302.18(~{WE})
NAND_nWP: R305.1 R313.1 U302.19(~{WP})
NAND_RnB: R312.1 U302.7(R/~{B})
NOR_FLSH_nCS: R317.1 R319.2 U303.4(~{CS})
NOR_FLSH_nRST: R318.1 U303.3(~{RESET})
NOR_FLSH_SCK: R316.1 U303.2(SCK)
NOR_FLSH_SI: R315.1 U303.1(SI)
NOR_FLSH_SO: R314.1 U303.8(SO)
NetR320_1: R320.1 U303.5(~{WP})

Not connected (* = marked no-connect by the designer): U300 40(NC)*; U301 40(NC)*; U302 1(NC)* 2(NC)* 3(NC)* 4(NC)* 5(NC)* 6(NC)* 10(NC)* 11(NC)* 14(NC)* 15(NC)* 20(NC)* 21(NC)* 22(NC)* 23(NC)* 24(NC)* 25(NC)* 26(NC)* 27(NC)* 28(NC)* 33(NC)* 34(NC)* 35(NC)* 39(NC)* 40(NC)* 45(NC)* 46(NC)* 47(NC)* 48(NC)*

### Buses and harness runs
bus EBI_A[2..14] = port EBI_A[2..14]
bus EBI_D[0..31] = port EBI_D[0..31]

### Library data of the parts
C300-C315 C317 C320 C321 = Cap: as C101 on sheet 01-POWER
C316 C318 C319 C322 = Cap: Ceramic Capacitor SMD 0603 10uF ±20% 10V
J300 = microSD card SDIO: microSD card socket
L300-L304 = Ferrite bead: Ferrite bead SMD 0603 120 Ohm @100MHz
R300 R302 R307-R318 R320-R322 = Res: Resistor SMD 0603 0R 1% 0.1W
R301 R303-R305 R319 = Res: Resistor SMD 0603 470K 1% 0.1W
R306 = Res: Resistor SMD 0603 1K 1% 0.1W
R323 R324 = Res: Resistor SMD 0603 4.7K 1% 0.1W
R325-R330 = Res: Resistor SMD 0603 1/10W 1%; Value: 1k
R331-R336 = Res: Resistor SMD 0603 10K 1% 0.1W
U300 U301 = MT48LC16M16A2-TG: 256Mb SDRAM (16Meg x 16)
U302 = K9F2G08UXA: Samsung 256M x 8 Bit NAND Flash Memory
U303 = AT45DB321D: Adesto Technologies 32Mb, 2.5V or 2.7V serial / DataFlash
U304 = AT24C32: Atmel 256Kb 2-wire serial EEPROM

## Sheet 04-ETHERNET.SchDoc
size A3
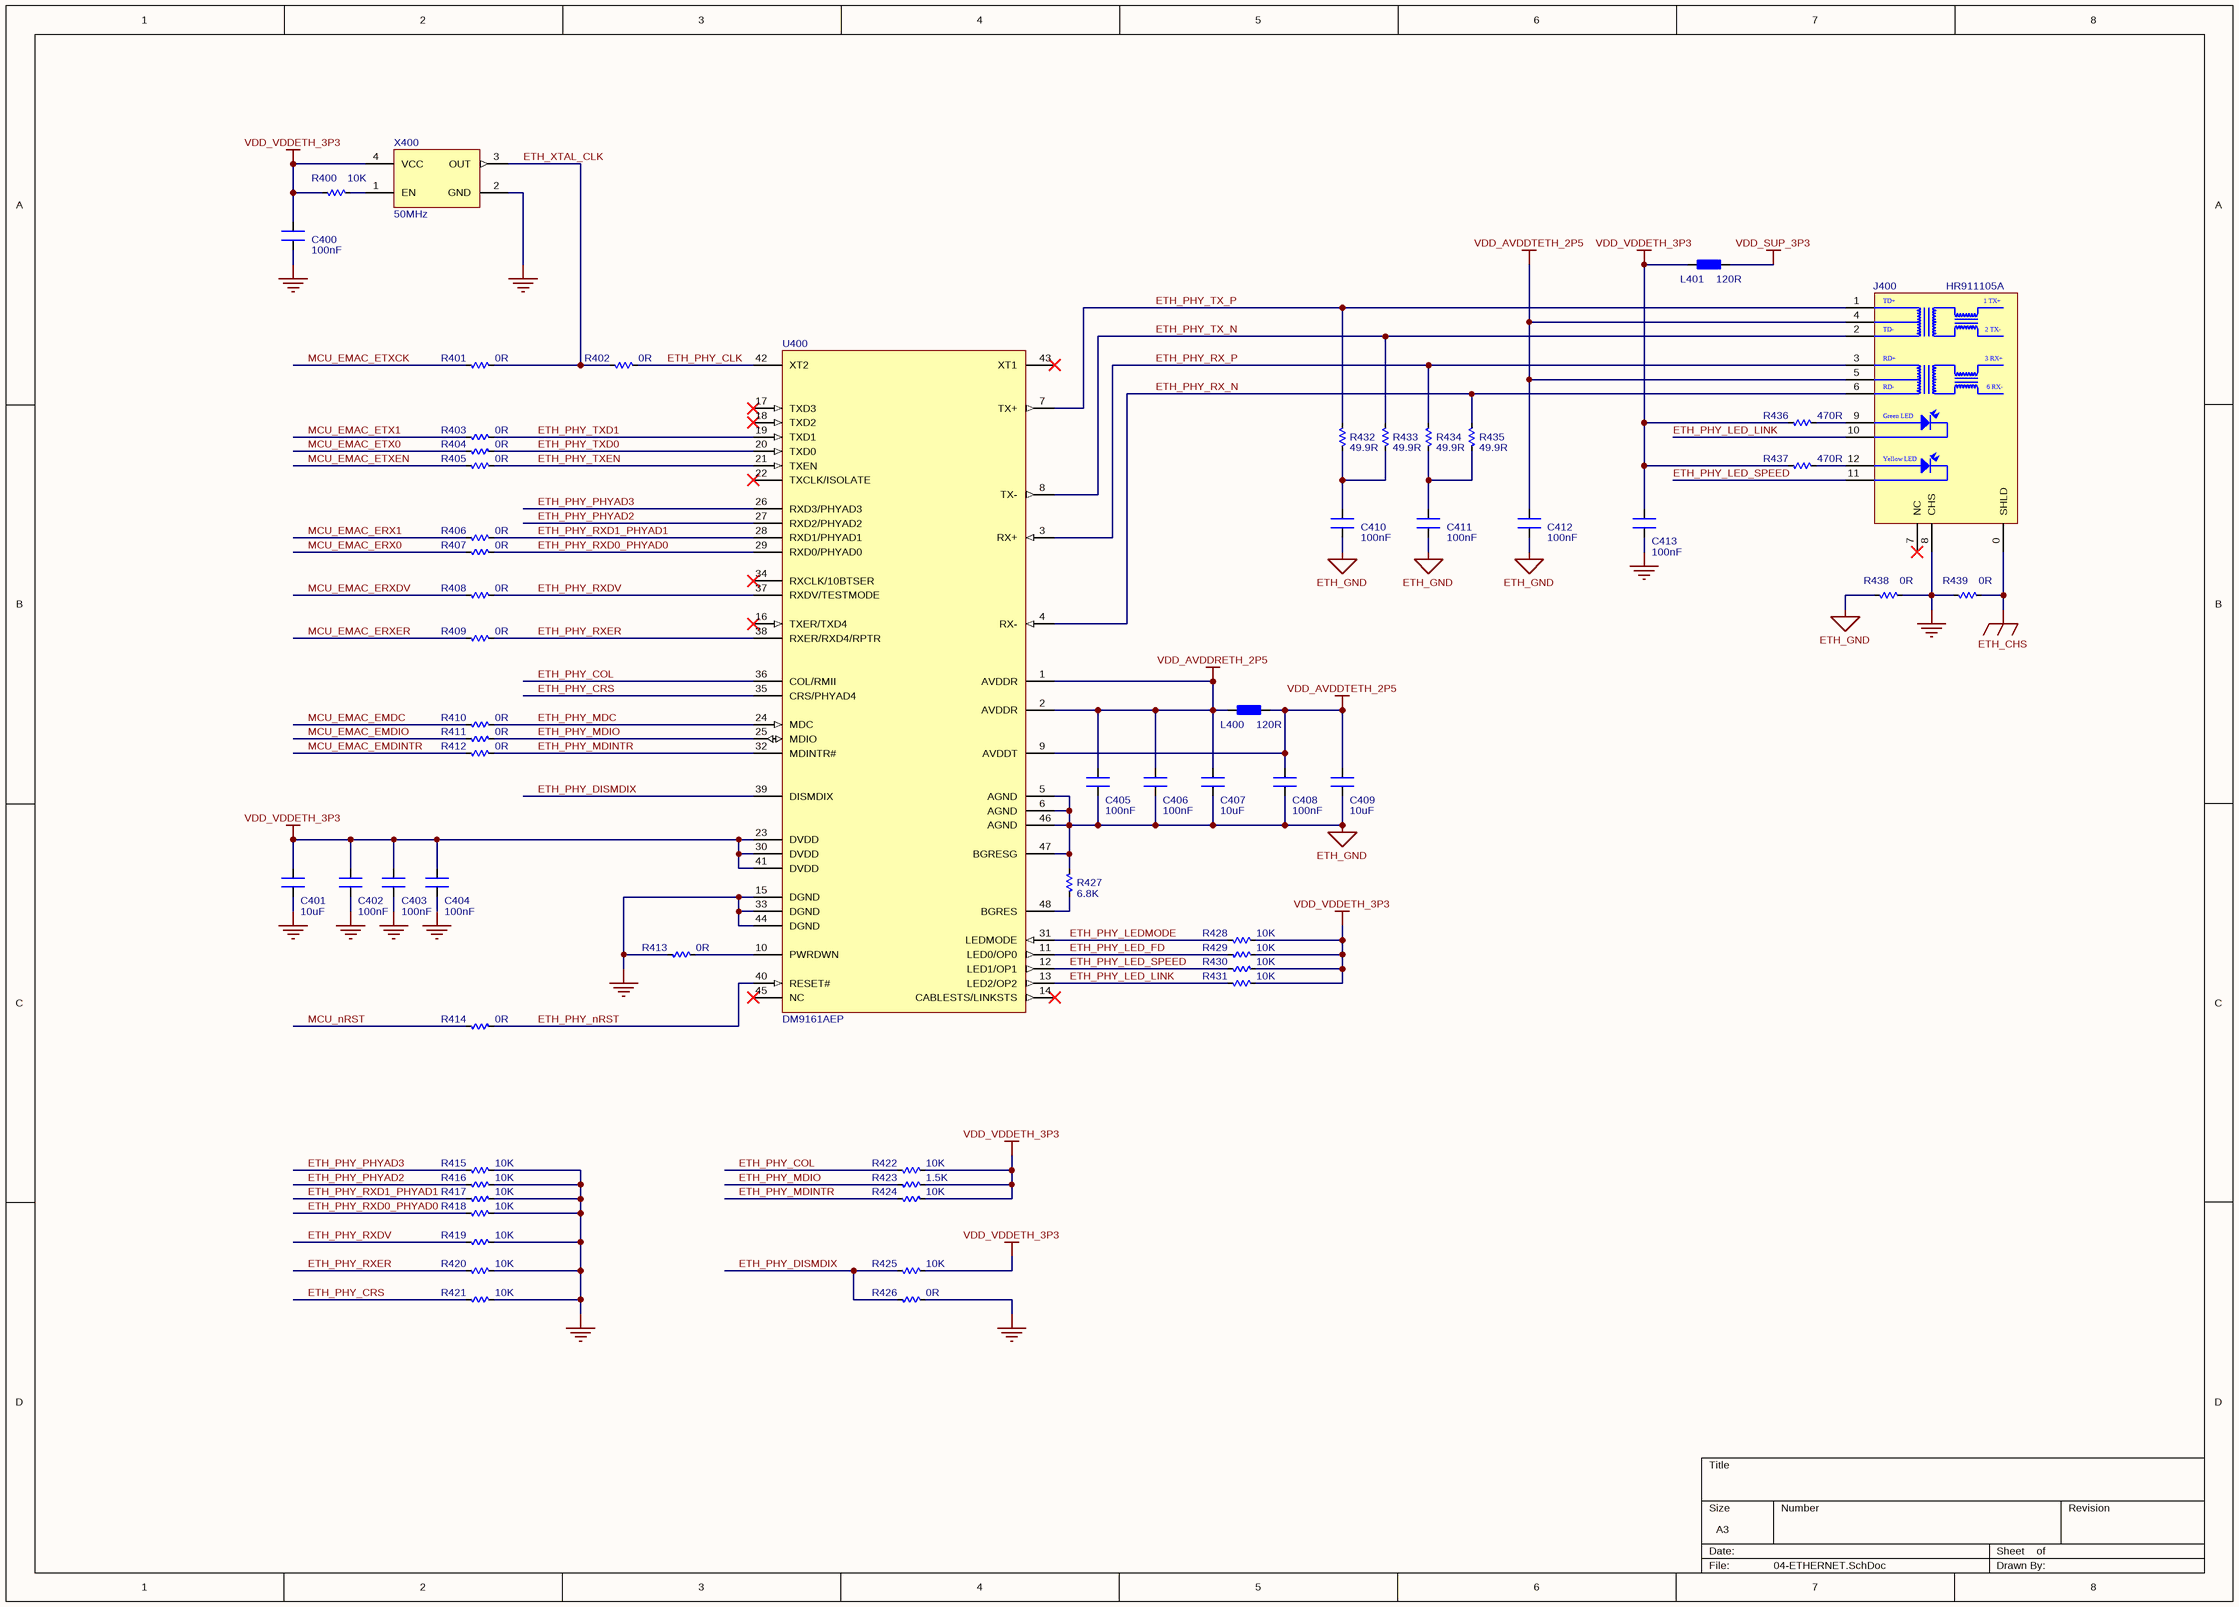
[diagram p3: 04-ETHERNET.SchDoc]

### Parts
C400  value 100nF  [CN-SMD-0603]  (hidden comment: Capacitor)
C401  value 10uF  [CN-SMD-0603]  (hidden comment: Capacitor)
C402  value 100nF  [CN-SMD-0603]  (hidden comment: Capacitor)
C403  value 100nF  [CN-SMD-0603]  (hidden comment: Capacitor)
C404  value 100nF  [CN-SMD-0603]  (hidden comment: Capacitor)
C405  value 100nF  [CN-SMD-0603]  (hidden comment: Capacitor)
C406  value 100nF  [CN-SMD-0603]  (hidden comment: Capacitor)
C407  value 10uF  [CN-SMD-0603]  (hidden comment: Capacitor)
C408  value 100nF  [CN-SMD-0603]  (hidden comment: Capacitor)
C409  value 10uF  [CN-SMD-0603]  (hidden comment: Capacitor)
C410  value 100nF  [CN-SMD-0603]  (hidden comment: Capacitor)
C411  value 100nF  [CN-SMD-0603]  (hidden comment: Capacitor)
C412  value 100nF  [CN-SMD-0603]  (hidden comment: Capacitor)
C413  value 100nF  [CN-SMD-0603]  (hidden comment: Capacitor)
J400  HR911105A  [RJ-45_HR911105A]
L400  value 120R  [L-SMD-0603]  (hidden comment: Ferrite bead)
L401  value 120R  [L-SMD-0603]  (hidden comment: Ferrite bead)
R400  value 10K  [RES-SMD-0603]  (hidden comment: Resistor)
R401  value 0R  [RES-SMD-0603]  (hidden comment: Resistor)
R402  value 0R  [RES-SMD-0603]  (hidden comment: Resistor)
R403  value 0R  [RES-SMD-0603]  (hidden comment: Resistor)
R404  value 0R  [RES-SMD-0603]  (hidden comment: Resistor)
R405  value 0R  [RES-SMD-0603]  (hidden comment: Resistor)
R406  value 0R  [RES-SMD-0603]  (hidden comment: Resistor)
R407  value 0R  [RES-SMD-0603]  (hidden comment: Resistor)
R408  value 0R  [RES-SMD-0603]  (hidden comment: Resistor)
R409  value 0R  [RES-SMD-0603]  (hidden comment: Resistor)
R410  value 0R  [RES-SMD-0603]  (hidden comment: Resistor)
R411  value 0R  [RES-SMD-0603]  (hidden comment: Resistor)
R412  value 0R  [RES-SMD-0603]  (hidden comment: Resistor)
R413  value 0R  [RES-SMD-0603]  (hidden comment: Resistor)
R414  value 0R  [RES-SMD-0603]  (hidden comment: Resistor)
R415  value 10K  [RES-SMD-0603]  (hidden comment: Resistor)
R416  value 10K  [RES-SMD-0603]  (hidden comment: Resistor)
R417  value 10K  [RES-SMD-0603]  (hidden comment: Resistor)
R418  value 10K  [RES-SMD-0603]  (hidden comment: Resistor)
R419  value 10K  [RES-SMD-0603]  (hidden comment: Resistor)
R420  value 10K  [RES-SMD-0603]  (hidden comment: Resistor)
R421  value 10K  [RES-SMD-0603]  (hidden comment: Resistor)
R422  value 10K  [RES-SMD-0603]  (hidden comment: Resistor)
R423  value 1.5K  [RES-SMD-0603]  (hidden comment: Resistor)
R424  value 10K  [RES-SMD-0603]  (hidden comment: Resistor)
R425  value 10K  [RES-SMD-0603]  (hidden comment: Resistor)
R426  value 0R  [RES-SMD-0603]  (hidden comment: Resistor)
R427  value 6.8K  [RES-SMD-0603]  (hidden comment: Resistor)
R428  value 10K  [RES-SMD-0603]  (hidden comment: Resistor)
R429  value 10K  [RES-SMD-0603]  (hidden comment: Resistor)
R430  value 10K  [RES-SMD-0603]  (hidden comment: Resistor)
R431  value 10K  [RES-SMD-0603]  (hidden comment: Resistor)
R432  value 49.9R  [RES-SMD-0603]  (hidden comment: Resistor)
R433  value 49.9R  [RES-SMD-0603]  (hidden comment: Resistor)
R434  value 49.9R  [RES-SMD-0603]  (hidden comment: Resistor)
R435  value 49.9R  [RES-SMD-0603]  (hidden comment: Resistor)
R436  value 470R  [RES-SMD-0603]  (hidden comment: Resistor)
R437  value 470R  [RES-SMD-0603]  (hidden comment: Resistor)
R438  value 0R  [RES-SMD-0603]  (hidden comment: Resistor)
R439  value 0R  [RES-SMD-1206]  (hidden comment: Resistor)
U400  DM9161AEP  [LQFP50P900X900X160-48N]
X400  50MHz  [XT-SMD-3225-4P]

### Nets
ETH_CHS: J400.0(SHLD) R439.1
ETH_GND: C405.1 C406.1 C407.1 C408.1 C409.1 C410.1 C411.1 C412.1 R427.1 R438.2 U400.5(AGND) U400.6(AGND) U400.46(AGND) U400.47(BGRESG)
GND: C400.1 C401.1 C402.1 C403.1 C404.1 C413.1 J400.8(CHS) R413.2 R415.1 R416.1 R417.1 R418.1 R419.1 R420.1 R421.1 R426.1 R438.1 R439.2 U400.15(DGND) U400.33(DGND) U400.44(DGND) X400.2(GND)
VDD_AVDDRETH_2P5: C405.2 C406.2 C407.2 L400.2 U400.1(AVDDR) U400.2(AVDDR)
VDD_AVDDTETH_2P5: C408.2 C409.2 C412.2 J400.4(2,5V) J400.5(2,5V) L400.1 U400.9(AVDDT)
VDD_SUP_3P3: L401.2
VDD_VDDETH_3P3: C400.2 C401.2 C402.2 C403.2 C404.2 C413.2 L401.1 R400.2 R422.1 R423.1 R424.1 R425.1 R428.1 R429.1 R430.1 R431.1 R436.2 R437.2 U400.23(DVDD) U400.30(DVDD) U400.41(DVDD) X400.4(VCC)
ETH_PHY_CLK: R402.1 U400.42(XT2)
ETH_PHY_COL: R422.2 U400.36(COL/RMII)
ETH_PHY_CRS: R421.2 U400.35(CRS/PHYAD4)
ETH_PHY_DISMDIX: R425.2 R426.2 U400.39(DISMDIX)
ETH_PHY_LED_FD: R429.2 U400.11(LED0/OP0)
ETH_PHY_LED_LINK: J400.10(Green-) R431.2 U400.13(LED2/OP2)
ETH_PHY_LED_SPEED: J400.11(Yellow-) R430.2 U400.12(LED1/OP1)
ETH_PHY_LEDMODE: R428.2 U400.31(LEDMODE)
ETH_PHY_MDC: R410.1 U400.24(MDC)
ETH_PHY_MDINTR: R412.1 R424.2 U400.32(MDINTR#)
ETH_PHY_MDIO: R411.1 R423.2 U400.25(MDIO)
ETH_PHY_nRST: R414.1 U400.40(RESET#)
ETH_PHY_PHYAD2: R416.2 U400.27(RXD2/PHYAD2)
ETH_PHY_PHYAD3: R415.2 U400.26(RXD3/PHYAD3)
ETH_PHY_RX_N: J400.6(RD-) R435.1 U400.4(RX-)
ETH_PHY_RX_P: J400.3(RD+) R434.1 U400.3(RX+)
ETH_PHY_RXD0_PHYAD0: R407.1 R418.2 U400.29(RXD0/PHYAD0)
ETH_PHY_RXD1_PHYAD1: R406.1 R417.2 U400.28(RXD1/PHYAD1)
ETH_PHY_RXDV: R408.1 R419.2 U400.37(RXDV/TESTMODE)
ETH_PHY_RXER: R409.1 R420.2 U400.38(RXER/RXD4/RPTR)
ETH_PHY_TX_N: J400.2(TD-) R433.1 U400.8(TX-)
ETH_PHY_TX_P: J400.1(TD+) R432.1 U400.7(TX+)
ETH_PHY_TXD0: R404.1 U400.20(TXD0)
ETH_PHY_TXD1: R403.1 U400.19(TXD1)
ETH_PHY_TXEN: R405.1 U400.21(TXEN)
ETH_XTAL_CLK: R401.1 R402.2 X400.3(OUT)
MCU_EMAC_EMDC: R410.2
MCU_EMAC_EMDINTR: R412.2
MCU_EMAC_EMDIO: R411.2
MCU_EMAC_ERX0: R407.2
MCU_EMAC_ERX1: R406.2
MCU_EMAC_ERXDV: R408.2
MCU_EMAC_ERXER: R409.2
MCU_EMAC_ETX0: R404.2
MCU_EMAC_ETX1: R403.2
MCU_EMAC_ETXCK: R401.2
MCU_EMAC_ETXEN: R405.2
MCU_nRST: R414.2
NetC410_2: C410.2 R432.2 R433.2
NetC411_2: C411.2 R434.2 R435.2
NetJ400_9: J400.9(Green+) R436.1
NetJ400_12: J400.12(Yellow+) R437.1
NetR400_1: R400.1 X400.1(EN)
NetR413_1: R413.1 U400.10(PWRDWN)
NetR427_2: R427.2 U400.48(BGRES)

Not connected (* = marked no-connect by the designer): J400 7(NC)*; U400 14(CABLESTS/LINKSTS)* 16(TXER/TXD4)* 17(TXD3)* 18(TXD2)* 22(TXCLK/ISOLATE)* 34(RXCLK/10BTSER)* 43(XT1)* 45(NC)*

### Notes on the sheet
- (in symbol HR911105A) 1 TX+; 2 TX-; 3 RX+; 6 RX-; Green LED; Yellow LED

### Library data of the parts
C400 C402-C406 C408 C410-C413 = Cap: as C101 on sheet 01-POWER
C401 C407 C409 = Cap: Ceramic Capacitor SMD 0603 10uF ±20% 10V
J400 = HR911105A: Single port RJ45 Connector with Integrated Magnetics and LED for 10/100-BaseTX NIC Applications
L400 L401 = Ferrite bead: Ferrite bead SMD 0603 120 Ohm @100MHz
R400 R415-R422 R424 R425 R428-R431 = Res: Resistor SMD 0603 10K 1% 0.1W
R401-R414 R426 R438 = Res: Resistor SMD 0603 0R 1% 0.1W
R423 = Res: Resistor SMD 0603 1.5K 1% 0.1W
R427 = Res: Resistor SMD 0603 6.8K 1% 0.1W
R432-R435 = Res: Resistor SMD 0603 49.9R 1% 0.1W
R436 R437 = Res: Resistor SMD 0603 470R 1% 0.1W
R439 = Res: Resistor SMD 1206 0R 1% 0.5W
U400 = DM9161AEP: DAVICOM 10/100Mbps Fast Ethernet Physical Layer Single Chip Transceiver
X400 = XT4_2: Crystal Oscillator SMD3225 4-pin

## Sheet 05-SERIAL&USB.SchDoc
size A3
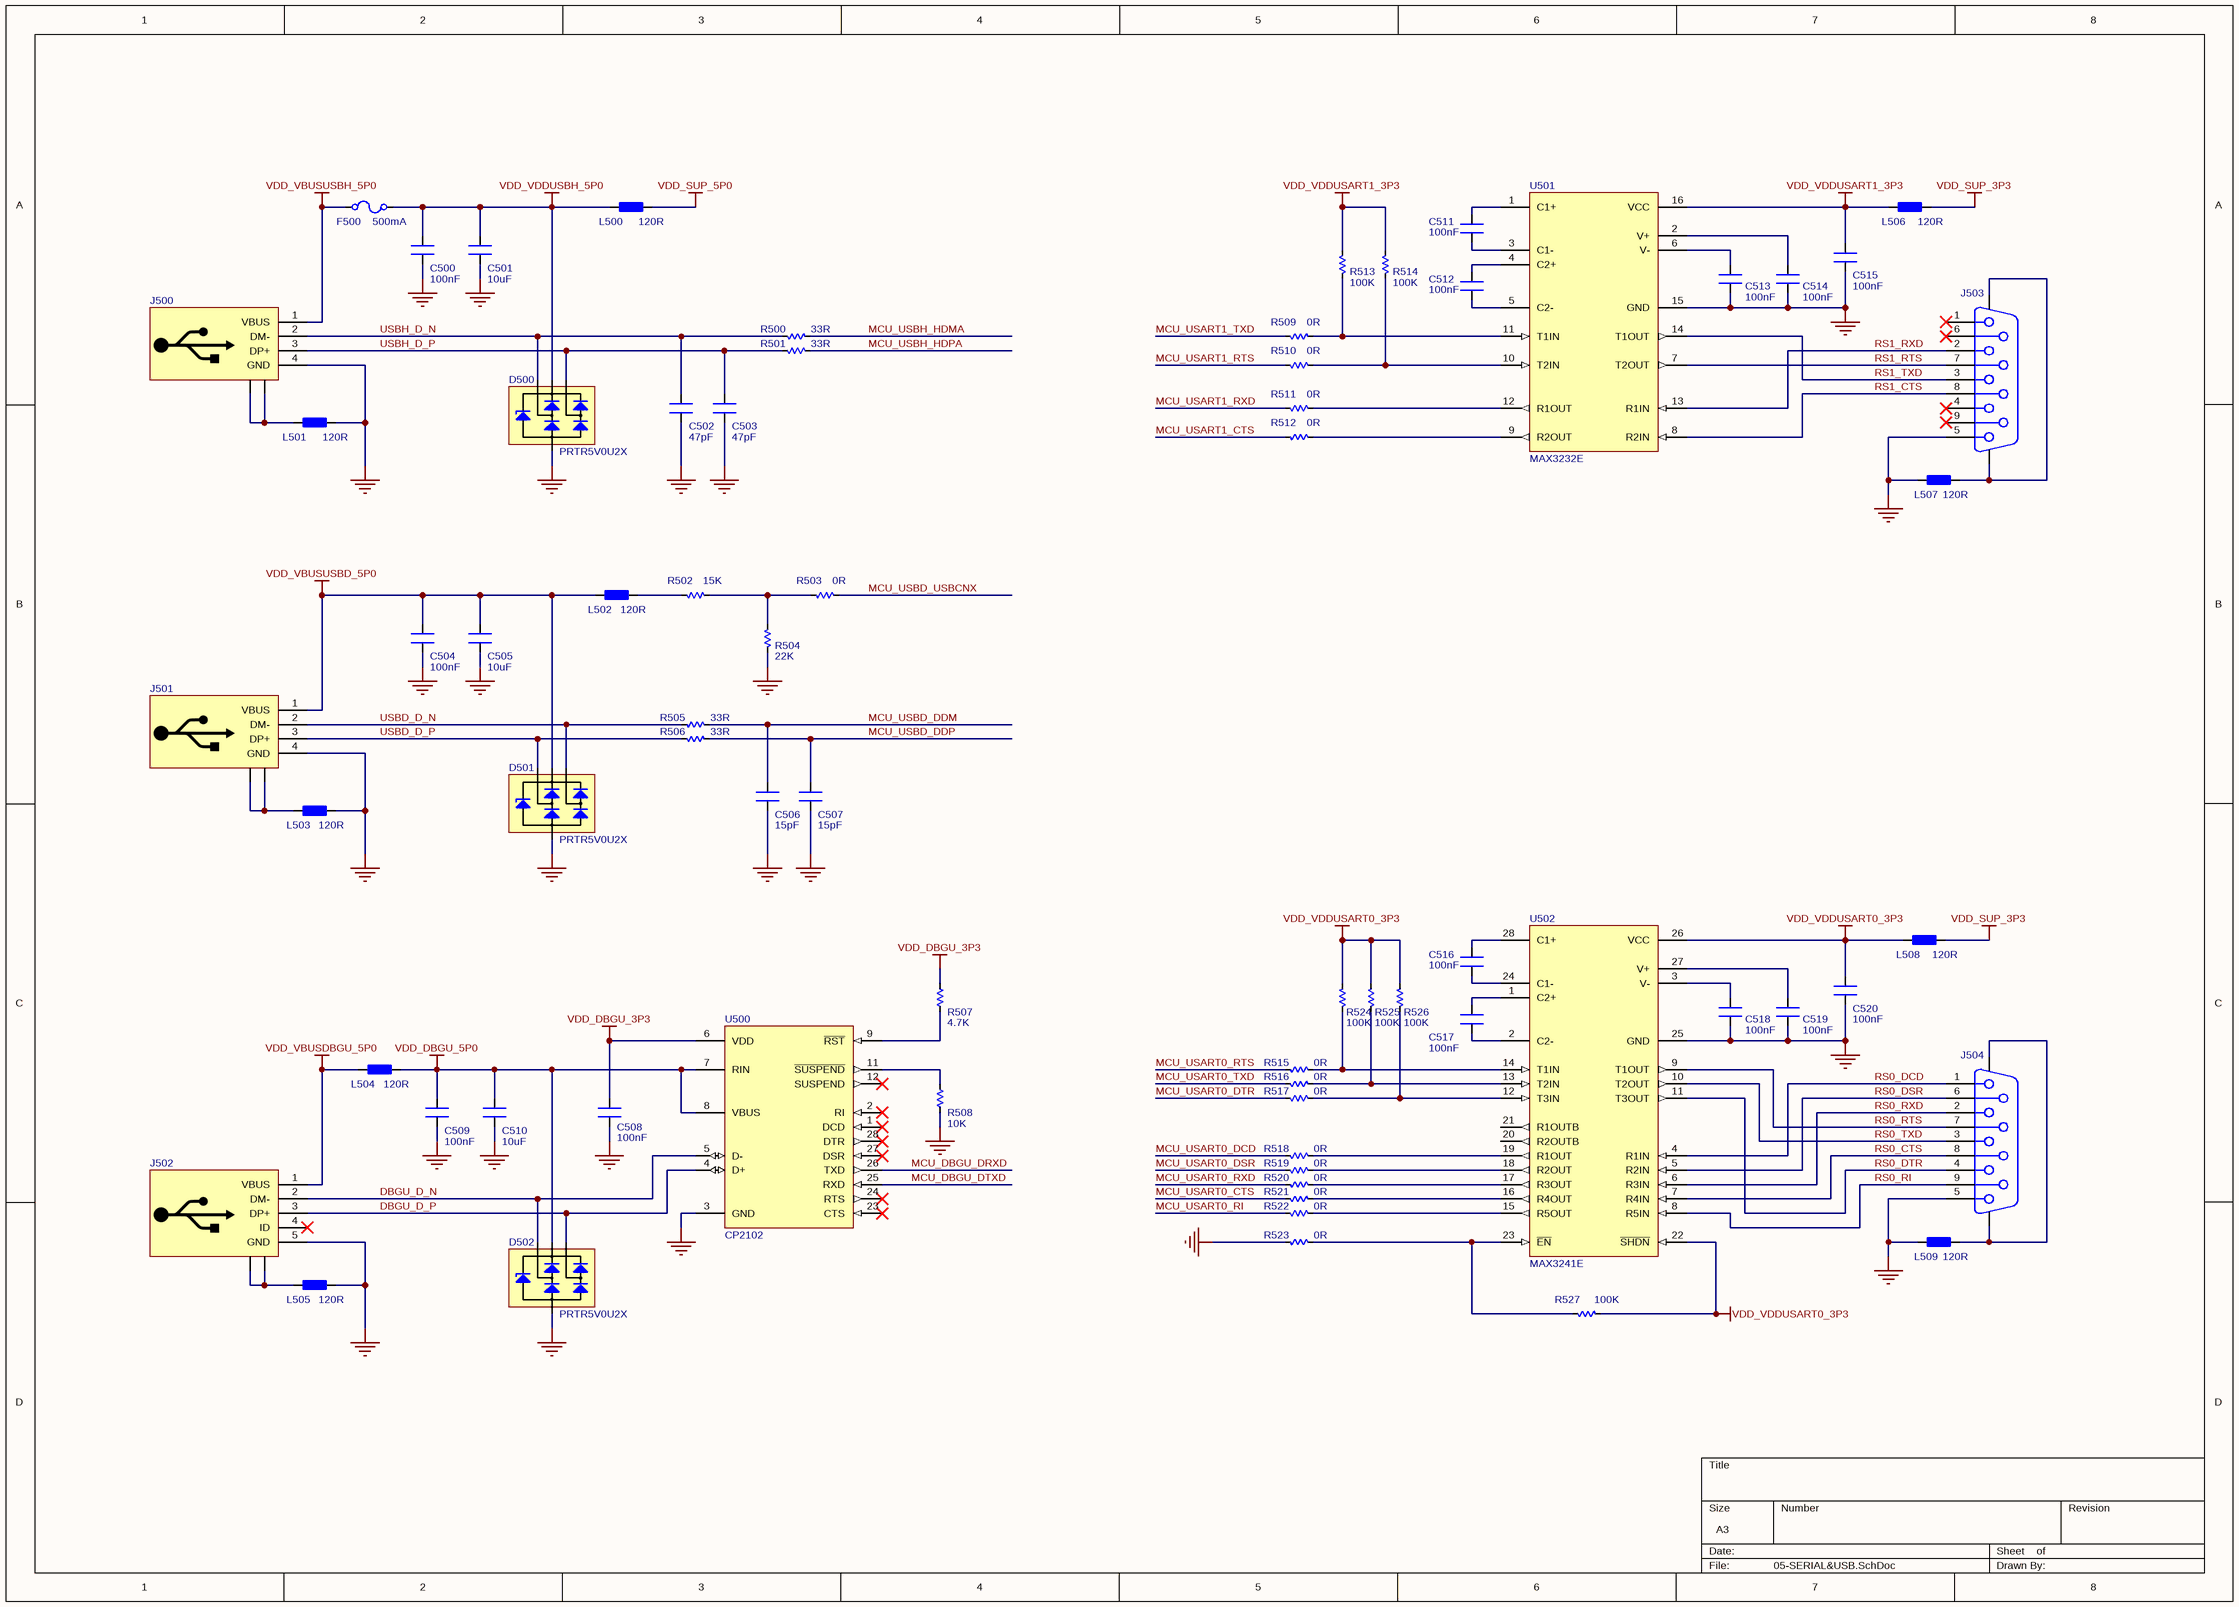
[diagram p4: 05-SERIAL&USB.SchDoc]

### Parts
C500  value 100nF  [CN-SMD-0603]  (hidden comment: Capacitor)
C501  value 10uF  [CN-SMD-0603]  (hidden comment: Capacitor)
C502  value 47pF  [CN-SMD-0603]  (hidden comment: Capacitor)
C503  value 47pF  [CN-SMD-0603]  (hidden comment: Capacitor)
C504  value 100nF  [CN-SMD-0603]  (hidden comment: Capacitor)
C505  value 10uF  [CN-SMD-0603]  (hidden comment: Capacitor)
C506  value 15pF  [CN-SMD-0603]  (hidden comment: Capacitor)
C507  value 15pF  [CN-SMD-0603]  (hidden comment: Capacitor)
C508  value 100nF  [CN-SMD-0603]  (hidden comment: Capacitor)
C509  value 100nF  [CN-SMD-0603]  (hidden comment: Capacitor)
C510  value 10uF  [CN-SMD-0603]  (hidden comment: Capacitor)
C511  value 100nF  [CN-SMD-0603]  (hidden comment: Capacitor)
C512  value 100nF  [CN-SMD-0603]  (hidden comment: Capacitor)
C513  value 100nF  [CN-SMD-0603]  (hidden comment: Capacitor)
C514  value 100nF  [CN-SMD-0603]  (hidden comment: Capacitor)
C515  value 100nF  [CN-SMD-0603]  (hidden comment: Capacitor)
C516  value 100nF  [CN-SMD-0603]  (hidden comment: Capacitor)
C517  value 100nF  [CN-SMD-0603]  (hidden comment: Capacitor)
C518  value 100nF  [CN-SMD-0603]  (hidden comment: Capacitor)
C519  value 100nF  [CN-SMD-0603]  (hidden comment: Capacitor)
C520  value 100nF  [CN-SMD-0603]  (hidden comment: Capacitor)
D500  PRTR5V0U2X  [SOT190P237X120-4N]
D501  PRTR5V0U2X  [SOT190P237X120-4N]
D502  PRTR5V0U2X  [SOT190P237X120-4N]
F500  500mA  [FUSE-SMD-1812]
J500  USB-4  [USB_A_F_DIP_RA]  (value not drawn)
J501  USB-4  [USB_B_F_DIP]  (value not drawn)
J502  USB-5  [USB_micro-B_F_SMD-2]  (value not drawn)
J503  DB9  [DB9_DIP_M]  (value not drawn)
J504  DB9  [DB9_DIP_M]  (value not drawn)
L500  value 120R  [L-SMD-0603]  (hidden comment: Ferrite bead)
L501  value 120R  [L-SMD-0603]  (hidden comment: Ferrite bead)
L502  value 120R  [L-SMD-0603]  (hidden comment: Ferrite bead)
L503  value 120R  [L-SMD-0603]  (hidden comment: Ferrite bead)
L504  value 120R  [L-SMD-0603]  (hidden comment: Ferrite bead)
L505  value 120R  [L-SMD-0603]  (hidden comment: Ferrite bead)
L506  value 120R  [L-SMD-0603]  (hidden comment: Ferrite bead)
L507  value 120R  [L-SMD-0603]  (hidden comment: Ferrite bead)
L508  value 120R  [L-SMD-0603]  (hidden comment: Ferrite bead)
L509  value 120R  [L-SMD-0603]  (hidden comment: Ferrite bead)
R500  value 33R  [RES-SMD-0603]  (hidden comment: Resistor)
R501  value 33R  [RES-SMD-0603]  (hidden comment: Resistor)
R502  value 15K  [RES-SMD-0603]  (hidden comment: Resistor)
R503  value 0R  [RES-SMD-0603]  (hidden comment: Resistor)
R504  value 22K  [RES-SMD-0603]  (hidden comment: Resistor)
R505  value 33R  [RES-SMD-0603]  (hidden comment: Resistor)
R506  value 33R  [RES-SMD-0603]  (hidden comment: Resistor)
R507  value 4.7K  [RES-SMD-0603]  (hidden comment: R)
R508  value 10K  [RES-SMD-0603]  (hidden comment: R)
R509  value 0R  [RES-SMD-0603]  (hidden comment: Resistor)
R510  value 0R  [RES-SMD-0603]  (hidden comment: Resistor)
R511  value 0R  [RES-SMD-0603]  (hidden comment: Resistor)
R512  value 0R  [RES-SMD-0603]  (hidden comment: Resistor)
R513  value 100K  [RES-SMD-0603]  (hidden comment: Resistor)
R514  value 100K  [RES-SMD-0603]  (hidden comment: Resistor)
R515  value 0R  [RES-SMD-0603]  (hidden comment: Resistor)
R516  value 0R  [RES-SMD-0603]  (hidden comment: Resistor)
R517  value 0R  [RES-SMD-0603]  (hidden comment: Resistor)
R518  value 0R  [RES-SMD-0603]  (hidden comment: Resistor)
R519  value 0R  [RES-SMD-0603]  (hidden comment: Resistor)
R520  value 0R  [RES-SMD-0603]  (hidden comment: Resistor)
R521  value 0R  [RES-SMD-0603]  (hidden comment: Resistor)
R522  value 0R  [RES-SMD-0603]  (hidden comment: Resistor)
R523  value 0R  [RES-SMD-0603]  (hidden comment: Resistor)
R524  value 100K  [RES-SMD-0603]  (hidden comment: Resistor)
R525  value 100K  [RES-SMD-0603]  (hidden comment: Resistor)
R526  value 100K  [RES-SMD-0603]  (hidden comment: Resistor)
R527  value 100K  [RES-SMD-0603]  (hidden comment: Resistor)
U500  CP2102  [QFN50P500X500X100_HS-29N]
U501  MAX3232E  [TSSOP65P640X120-16N]
U502  MAX3241E  [SSOP65P780X200-28N]

### Nets
GND: C500.1 C501.1 C502.1 C503.1 C504.1 C505.1 C506.1 C507.1 C508.1 C509.1 C510.1 C513.1 C514.1 C515.1 C518.1 C519.1 C520.1 D500.1(GND) D501.1(GND) D502.1(GND) J500.4(GND) J501.4(GND) J502.5(GND) J503.5(GND) J504.5(GND) L501.1 L503.2 L505.2 L507.1 L509.1 R504.2 R508.1 R523.2 U500.3(GND) U501.15(GND) U502.25(GND)
VDD_DBGU_3P3: C508.2 R507.2 U500.6(VDD)
VDD_DBGU_5P0: C509.2 C510.2 D502.4(VDD) L504.2 U500.7(RIN) U500.8(VBUS)
VDD_SUP_3P3: L506.2 L508.2
VDD_SUP_5P0: L500.2
VDD_VBUSDBGU_5P0: J502.1(VBUS) L504.1
VDD_VBUSUSBD_5P0: C504.2 C505.2 D501.4(VDD) J501.1(VBUS) L502.1
VDD_VBUSUSBH_5P0: F500.1 J500.1(VBUS)
VDD_VDDUSART0_3P3: C520.2 L508.1 R524.1 R525.1 R526.1 R527.1 U502.22(~{SHDN}) U502.26(VCC)
VDD_VDDUSART1_3P3: C515.2 L506.1 R513.1 R514.1 U501.16(VCC)
VDD_VDDUSBH_5P0: C500.2 C501.2 D500.4(VDD) F500.2 L500.1
DBGU_D_N: D502.2 J502.2(DM-) U500.5(D-)
DBGU_D_P: D502.3 J502.3(DP+) U500.4(D+)
MCU_DBGU_DRXD: U500.26(TXD)
MCU_DBGU_DTXD: U500.25(RXD)
MCU_USART0_CTS: R521.2
MCU_USART0_DCD: R518.2
MCU_USART0_DSR: R519.2
MCU_USART0_DTR: R517.2
MCU_USART0_RI: R522.2
MCU_USART0_RTS: R515.2
MCU_USART0_RXD: R520.2
MCU_USART0_TXD: R516.2
MCU_USART1_CTS: R512.2
MCU_USART1_RTS: R510.2
MCU_USART1_RXD: R511.2
MCU_USART1_TXD: R509.2
MCU_USBD_DDM: C506.2 R505.1
MCU_USBD_DDP: C507.2 R506.1
MCU_USBD_USBCNX: R503.1
MCU_USBH_HDMA: R500.1
MCU_USBH_HDPA: R501.1
RS0_CTS: J504.8(CTS) U502.7(R4IN)
RS0_DCD: J504.1(DCD) U502.4(R1IN)
RS0_DSR: J504.6(DSR) U502.5(R2IN)
RS0_DTR: J504.4(DTR) U502.11(T3OUT)
RS0_RI: J504.9(RI) U502.8(R5IN)
RS0_RTS: J504.7(RTS) U502.9(T1OUT)
RS0_RXD: J504.2(RXD) U502.6(R3IN)
RS0_TXD: J504.3(TXD) U502.10(T2OUT)
RS1_CTS: J503.8(CTS) U501.8(R2IN)
RS1_RTS: J503.7(RTS) U501.7(T2OUT)
RS1_RXD: J503.2(RXD) U501.13(R1IN)
RS1_TXD: J503.3(TXD) U501.14(T1OUT)
USBD_D_N: D501.3 J501.2(DM-) R505.2
USBD_D_P: D501.2 J501.3(DP+) R506.2
USBH_D_N: C502.2 D500.2 J500.2(DM-) R500.2
USBH_D_P: C503.2 D500.3 J500.3(DP+) R501.2
NetC511_1: C511.1 U501.3(C1-)
NetC511_2: C511.2 U501.1(C1+)
NetC512_1: C512.1 U501.5(C2-)
NetC512_2: C512.2 U501.4(C2+)
NetC513_2: C513.2 U501.6(V-)
NetC514_2: C514.2 U501.2(V+)
NetC516_1: C516.1 U502.24(C1-)
NetC516_2: C516.2 U502.28(C1+)
NetC517_1: C517.1 U502.2(C2-)
NetC517_2: C517.2 U502.1(C2+)
NetC518_2: C518.2 U502.3(V-)
NetC519_2: C519.2 U502.27(V+)
NetJ500_0: J500.0 L501.2
NetJ501_0: J501.0 L503.1
NetJ502_0: J502.0 L505.1
NetJ503_10: J503.10 J503.11 L507.2
NetJ504_10: J504.10 J504.11 L509.2
NetL502_2: L502.2 R502.2
NetR502_1: R502.1 R503.2 R504.1
NetR507_1: R507.1 U500.9(~{RST})
NetR508_2: R508.2 U500.11(~{SUSPEND})
NetR509_1: R509.1 R513.2 U501.11(T1IN)
NetR510_1: R510.1 R514.2 U501.10(T2IN)
NetR511_1: R511.1 U501.12(R1OUT)
NetR512_1: R512.1 U501.9(R2OUT)
NetR515_1: R515.1 R524.2 U502.14(T1IN)
NetR516_1: R516.1 R525.2 U502.13(T2IN)
NetR517_1: R517.1 R526.2 U502.12(T3IN)
NetR518_1: R518.1 U502.19(R1OUT)
NetR519_1: R519.1 U502.18(R2OUT)
NetR520_1: R520.1 U502.17(R3OUT)
NetR521_1: R521.1 U502.16(R4OUT)
NetR522_1: R522.1 U502.15(R5OUT)
NetR523_1: R523.1 R527.2 U502.23(~{EN})

Not connected (* = marked no-connect by the designer): J502 4(ID)*; J503 1(DCD)* 4(DTR)* 6(DSR)* 9(RI)*; U500 1(DCD)* 2(RI)* 12(SUSPEND)* 23(CTS)* 24(RTS)* 27(DSR)* 28(DTR)*; U502 20(R2OUTB) 21(R1OUTB)

### Library data of the parts
C500 C504 C508 C509 C511-C520 = Cap: as C101 on sheet 01-POWER
C501 C505 C510 = Cap: Ceramic Capacitor SMD 0603 10uF ±20% 10V
C502 C503 = Cap: Ceramic Capacitor SMD 0603 47pF ±20% 10V
C506 C507 = Cap: Ceramic Capacitor SMD 0603 15pF ±20% 10V
D500-D502 = PRTR5V0U2X: Ultra low capacitance double rail-to-rail ESD protection diode
F500 = FUSE: Fuse SMD1812 500mA
J500 = USB-4: USB Male/Female type A
J501 = USB-4: USB Male/Female type B
J502 = USB-5: USB Female type B
J503 J504 = DB9: DB-9 Female port
L500-L509 = Ferrite bead: Ferrite bead SMD 0603 120 Ohm @100MHz
R500 R501 R505 R506 = Res: Resistor SMD 0603 33R 1% 0.1W
R502 = Res: Resistor SMD 0603 15K 1% 0.1W
R503 R509-R512 R515-R523 = Res: Resistor SMD 0603 0R 1% 0.1W
R504 = Res: Resistor SMD 0603 22K 1% 0.1W
R507 = Res: Resistor SMD 0603 4.7K 1% 0.1W
R508 = Res: Resistor SMD 0603 10K 1% 0.1W
R513 R514 R524-R527 = Res: Resistor SMD 0603 100K 1% 0.1W
U500 = CP2102: Single chip USB-to-UART Bridge
U501 = MAX3232E: Maxim Integrated ±15kV ESD-Protected, Down to 10nA, 3.0V to 5.5V, Up to 1Mbps, True RS-232 Transceivers
U502 = MAX3241E: Maxim Integrated ±15kV ESD-Protected, Down to 10nA, 3.0V to 5.5V, Up to 1Mbps, True RS-232 Transceivers

## Sheet 06-AUDIO.SchDoc
size A3
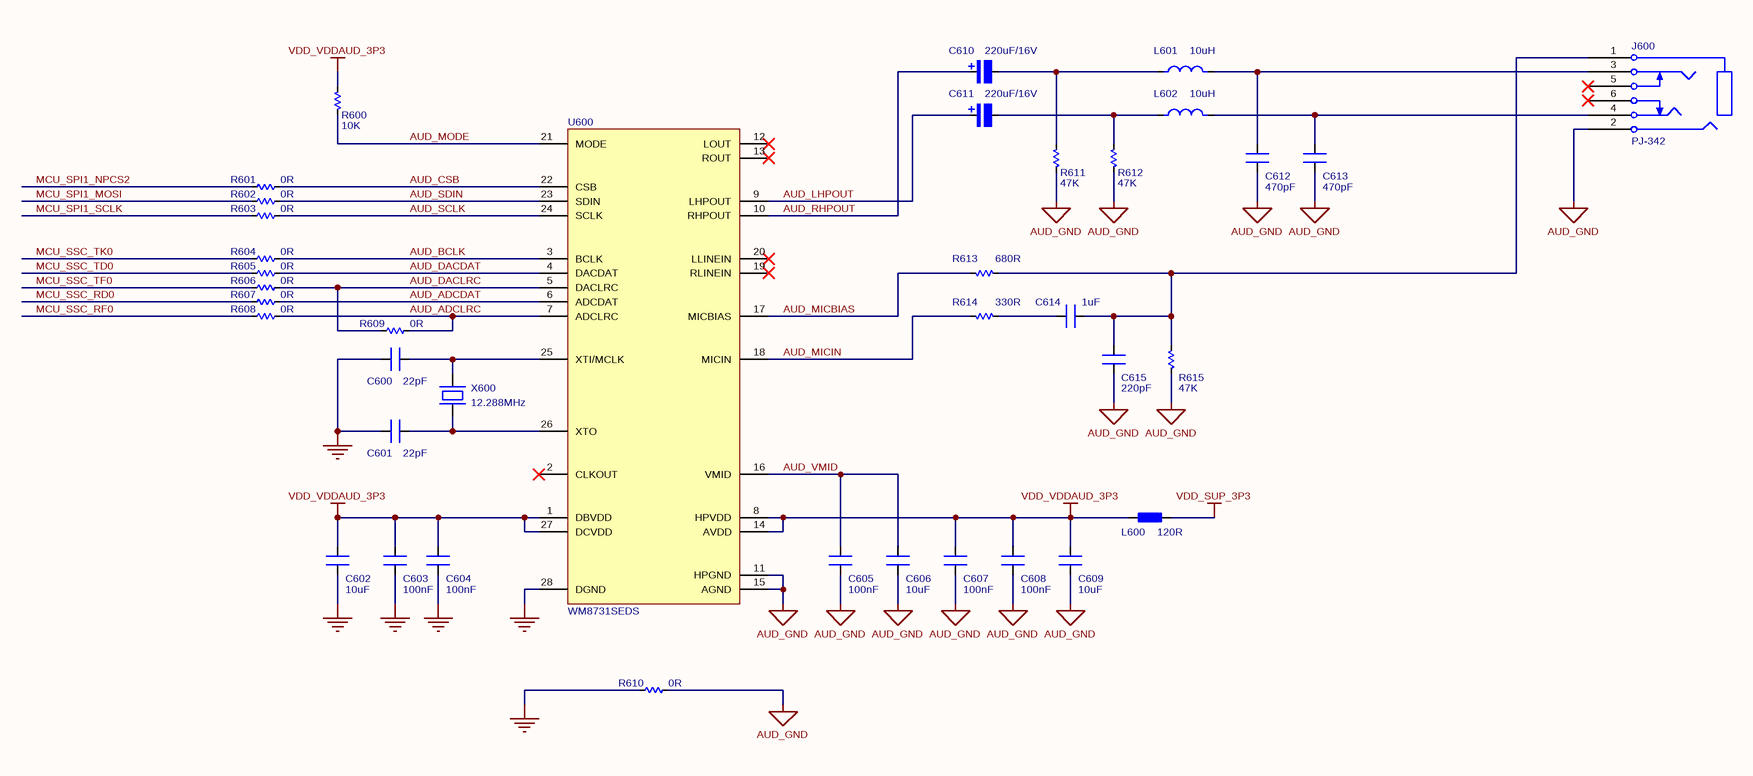
[diagram p5: 06-AUDIO.SchDoc]

### Parts
C600  value 22pF  [CN-SMD-0603]  (hidden comment: Capacitor)
C601  value 22pF  [CN-SMD-0603]  (hidden comment: Capacitor)
C602  value 10uF  [CN-SMD-0603]  (hidden comment: Capacitor)
C603  value 100nF  [CN-SMD-0603]  (hidden comment: Capacitor)
C604  value 100nF  [CN-SMD-0603]  (hidden comment: Capacitor)
C605  value 100nF  [CN-SMD-0603]  (hidden comment: Capacitor)
C606  value 10uF  [CN-SMD-0603]  (hidden comment: Capacitor)
C607  value 100nF  [CN-SMD-0603]  (hidden comment: Capacitor)
C608  value 100nF  [CN-SMD-0603]  (hidden comment: Capacitor)
C609  value 10uF  [CN-SMD-0603]  (hidden comment: Capacitor)
C610  value 220uF/16V  [C-TAL-SMD-3216-18]  (hidden comment: Cap_Tantalum)
C611  value 220uF/16V  [C-TAL-SMD-3216-18]  (hidden comment: Cap_Tantalum)
C612  value 470pF  [CN-SMD-0603]  (hidden comment: Capacitor)
C613  value 470pF  [CN-SMD-0603]  (hidden comment: Capacitor)
C614  value 1uF  [CN-SMD-0603]  (hidden comment: Capacitor)
C615  value 220pF  [CN-SMD-0603]  (hidden comment: Capacitor)
J600  PJ-342  [AUDIO_PJ-342]
L600  value 120R  [L-SMD-0603]  (hidden comment: Ferrite bead)
L601  value 10uH  [L-SMD-0603]  (hidden comment: Inductor)
L602  value 10uH  [L-SMD-0603]  (hidden comment: Inductor)
R600  value 10K  [RES-SMD-0603]  (hidden comment: Resistor)
R601  value 0R  [RES-SMD-0603]  (hidden comment: Resistor)
R602  value 0R  [RES-SMD-0603]  (hidden comment: Resistor)
R603  value 0R  [RES-SMD-0603]  (hidden comment: Resistor)
R604  value 0R  [RES-SMD-0603]  (hidden comment: Resistor)
R605  value 0R  [RES-SMD-0603]  (hidden comment: Resistor)
R606  value 0R  [RES-SMD-0603]  (hidden comment: Resistor)
R607  value 0R  [RES-SMD-0603]  (hidden comment: Resistor)
R608  value 0R  [RES-SMD-0603]  (hidden comment: Resistor)
R609  value 0R  [RES-SMD-0603]  (hidden comment: Resistor)
R610  value 0R  [RES-SMD-0603]  (hidden comment: Resistor)
R611  value 47K  [RES-SMD-0603]  (hidden comment: Resistor)
R612  value 47K  [RES-SMD-0603]  (hidden comment: Resistor)
R613  value 680R  [RES-SMD-0603]  (hidden comment: Resistor)
R614  value 330R  [RES-SMD-0603]  (hidden comment: Resistor)
R615  value 47K  [RES-SMD-0603]  (hidden comment: Resistor)
U600  WM8731SEDS  [SSOP65P780X200-28N]
X600  value 12.288MHz  [XT-SMD-5032-2P]  (hidden comment: Crystal)

### Nets
AUD_GND: C605.1 C606.1 C607.1 C608.1 C609.1 C612.1 C613.1 C615.1 J600.2(GND) R610.1 R611.2 R612.2 R615.2 U600.11(HPGND) U600.15(AGND)
GND: C600.2 C601.2 C602.1 C603.1 C604.1 R610.2 U600.28(DGND)
VDD_SUP_3P3: L600.2
VDD_VDDAUD_3P3: C602.2 C603.2 C604.2 C607.2 C608.2 C609.2 L600.1 R600.1 U600.1(DBVDD) U600.8(HPVDD) U600.14(AVDD) U600.27(DCVDD)
AUD_ADCDAT: R607.1 U600.6(ADCDAT)
AUD_ADCLRC: R608.1 R609.1 U600.7(ADCLRC)
AUD_BCLK: R604.1 U600.3(BCLK)
AUD_CSB: R601.1 U600.22(CSB)
AUD_DACDAT: R605.1 U600.4(DACDAT)
AUD_DACLRC: R606.1 R609.2 U600.5(DACLRC)
AUD_LHPOUT: C611.1 U600.9(LHPOUT)
AUD_MICBIAS: R613.1 U600.17(MICBIAS)
AUD_MICIN: R614.1 U600.18(MICIN)
AUD_MODE: R600.2 U600.21(MODE)
AUD_RHPOUT: C610.1 U600.10(RHPOUT)
AUD_SCLK: R603.1 U600.24(SCLK)
AUD_SDIN: R602.1 U600.23(SDIN)
AUD_VMID: C605.2 C606.2 U600.16(VMID)
MCU_SPI1_MOSI: R602.2
MCU_SPI1_NPCS2: R601.2
MCU_SPI1_SCLK: R603.2
MCU_SSC_RD0: R607.2
MCU_SSC_RF0: R608.2
MCU_SSC_TD0: R605.2
MCU_SSC_TF0: R606.2
MCU_SSC_TK0: R604.2
NetC600_1: C600.1 U600.25(XTI/MCLK) X600.1
NetC601_1: C601.1 U600.26(XTO) X600.2
NetC610_2: C610.2 L601.2 R611.1
NetC611_2: C611.2 L602.2 R612.1
NetC612_2: C612.2 J600.3(RIGHT) L601.1
NetC613_2: C613.2 J600.4(LEFT) L602.1
NetC614_1: C614.1 C615.2 J600.1(MIC) R613.2 R615.1
NetC614_2: C614.2 R614.2

Not connected (* = marked no-connect by the designer): J600 5* 6*; U600 2(CLKOUT)* 12(LOUT)* 13(ROUT)* 19(RLINEIN)* 20(LLINEIN)*

### Library data of the parts
C600 C601 = Cap: Ceramic Capacitor SMD 0603 22pF ±20% 10V
C602 C606 C609 = Cap: Ceramic Capacitor SMD 0603 10uF ±20% 10V
C603-C605 C607 C608 = Cap: as C101 on sheet 01-POWER
C610 C611 = Cap_Tantalum: Tantalum Capacitor SMD 3216 220uF ±20% 16V
C612 C613 = Cap: Ceramic Capacitor SMD 0603 470pF ±20% 10V
C614 = Cap: Ceramic Capacitor SMD 0603 1uF ±20% 10V
C615 = Cap: Ceramic Capacitor SMD 0603 220pF ±20% 10V
J600 = PJ-342: Audio connector PJ-342 3.5mm 4-pole; Connector type: AUDIO BLACK HEADER; Category: Connector; Status: Production
L600 = Ferrite bead: Ferrite bead SMD 0603 120 Ohm @100MHz
L601 L602 = Inductor: Common Inductor SMD 0603 10uH ±20%
R600 = Res: Resistor SMD 0603 10K 1% 0.1W
R601-R610 = Res: Resistor SMD 0603 0R 1% 0.1W
R611 R612 R615 = Res: Resistor SMD 0603 47K 1% 0.1W
R613 = Res: Resistor SMD 0603 680R 1% 0.1W
R614 = Res: Resistor SMD 0603 330R 1% 0.1W
U600 = WM8731SEDS: Cirrus Logic Portable Internet Audio CODEC with Headphone Driver and Programmable Sample Rates
X600 = XT2: Crystal Oscillator 12.288MHz SMD-5032 2-pin

## Sheet 07-MISC.SchDoc
size A4
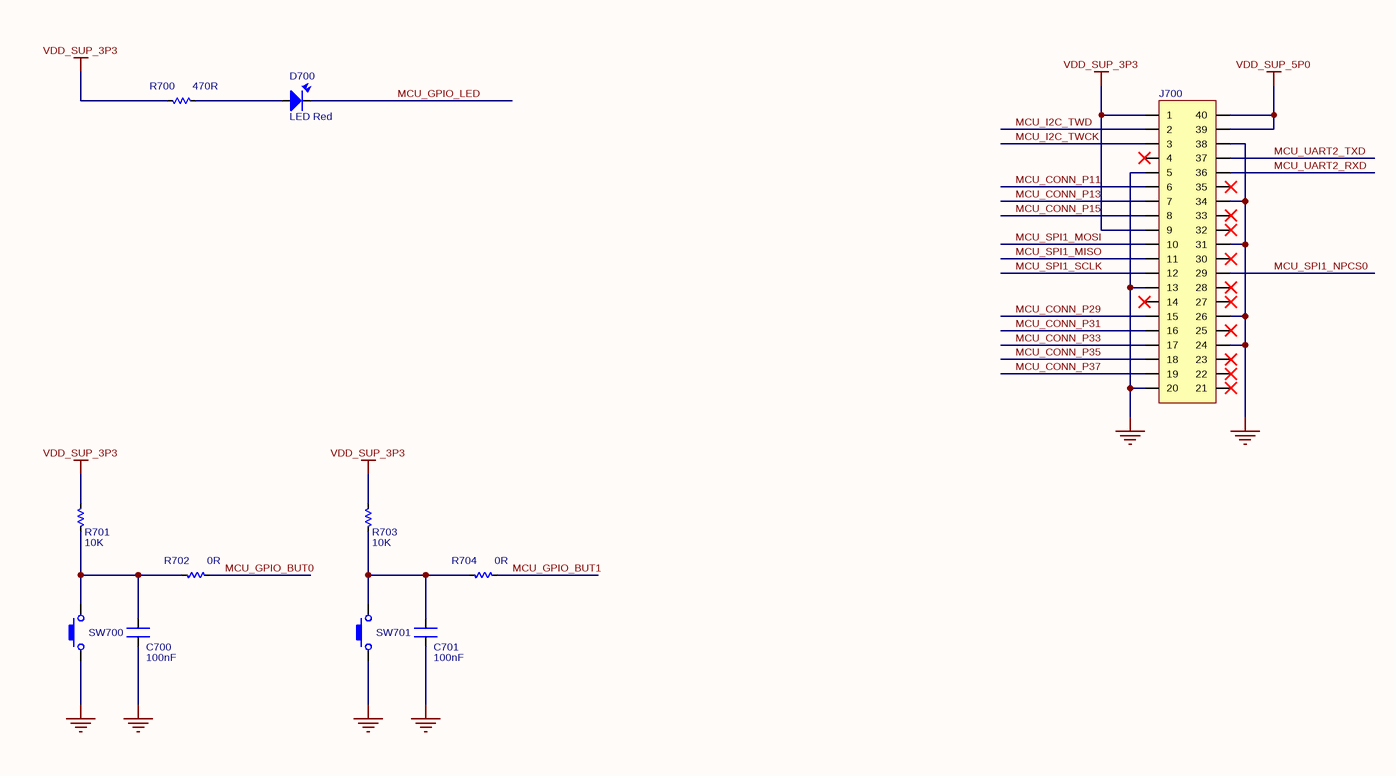
[diagram p6: 07-MISC.SchDoc]

### Parts
C700  value 100nF  [CN-SMD-0603]  (hidden comment: Capacitor)
C701  value 100nF  [CN-SMD-0603]  (hidden comment: Capacitor)
D700  LED Red  [LED-SMD-0805-RED]
J700  JP20x2  [JP20-D2T]  (value not drawn)
R700  value 470R  [RES-SMD-0603]  (hidden comment: Resistor)
R701  value 10K  [RES-SMD-0603]  (hidden comment: Resistor)
R702  value 0R  [RES-SMD-0603]  (hidden comment: Resistor)
R703  value 10K  [RES-SMD-0603]  (hidden comment: Resistor)
R704  value 0R  [RES-SMD-0603]  (hidden comment: Resistor)
SW700  SW2  [SW2-SMD-3x4x2M]  (value not drawn)
SW701  SW2  [SW2-SMD-3x4x2M]  (value not drawn)

### Nets
GND: C700.1 C701.1 J700.5 J700.13 J700.20 J700.24 J700.26 J700.31 J700.34 J700.38 SW700.1 SW701.1
VDD_SUP_3P3: J700.1 J700.9 R700.1 R701.1 R703.1
VDD_SUP_5P0: J700.39 J700.40
MCU_CONN_P11: J700.6
MCU_CONN_P13: J700.7
MCU_CONN_P15: J700.8
MCU_CONN_P29: J700.15
MCU_CONN_P31: J700.16
MCU_CONN_P33: J700.17
MCU_CONN_P35: J700.18
MCU_CONN_P37: J700.19
MCU_GPIO_BUT0: R702.2
MCU_GPIO_BUT1: R704.2
MCU_GPIO_LED: D700.2
MCU_I2C_TWCK: J700.3
MCU_I2C_TWD: J700.2
MCU_SPI1_MISO: J700.11
MCU_SPI1_MOSI: J700.10
MCU_SPI1_NPCS0: J700.29
MCU_SPI1_SCLK: J700.12
MCU_UART2_RXD: J700.36
MCU_UART2_TXD: J700.37
NetC700_2: C700.2 R701.2 R702.1 SW700.2
NetC701_2: C701.2 R703.2 R704.1 SW701.2
NetD700_1: D700.1 R700.2

Not connected (* = marked no-connect by the designer): J700 4* 14* 21* 22* 23* 25* 27* 28* 30* 32* 33* 35*

### Library data of the parts
C700 C701 = Cap: as C101 on sheet 01-POWER
D700 = LED: Light Emitting Diode SMD 0805 red color
J700 = JP20x2: Double 20-pin jumper
R700 = Res: Resistor SMD 0603 470R 1% 0.1W
R701 R703 = Res: Resistor SMD 0603 10K 1% 0.1W
R702 R704 = Res: Resistor SMD 0603 0R 1% 0.1W
SW700 SW701 = SW2: Switch 2-pin SMD 3x4x2mm